# Altium project Power_Board.PrjPcb (part 1 of 3)
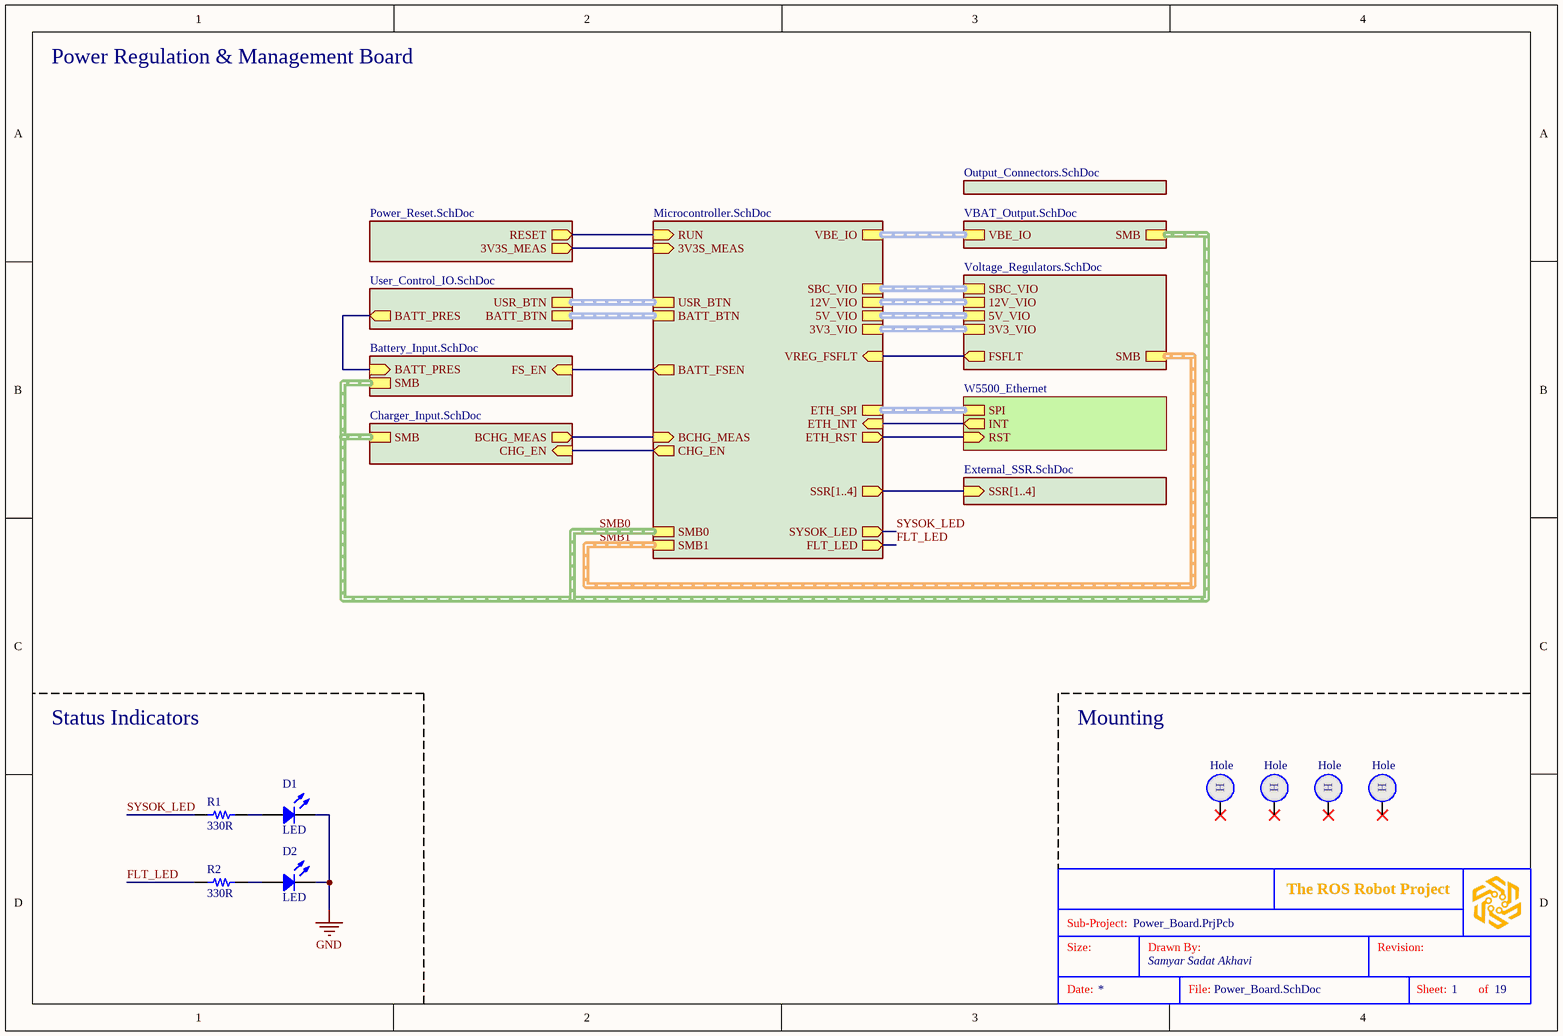
[diagram p0: Power_Board.SchDoc]
MainProjectName: The ROS Robot Project
16 sheets, 391 parts. Net scope: hierarchical (ports join the sheet entries above them; power ports are global).
Board file: Power_Board.PcbDoc
Sheets:
  Power_Board.SchDoc
    VOLT_REGS = Voltage_Regulators.SchDoc
      VREG_12V = Voltage_Reg_12V.SchDoc
      VREG_SBC = Voltage_Reg_SBC.SchDoc
      PROT_3V3 = STD_Protect.SchDoc
      PROT_SBC = HPW_Protect_SBC.SchDoc
      PROT_12V = STD_Protect.SchDoc
      VREG_3V3 = Voltage_Buck_3A.SchDoc
      PROT_5V = STD_Protect.SchDoc
      VREG_5V = Voltage_Buck_3A.SchDoc
    PWR = Power_Reset.SchDoc
    MCU = Microcontroller.SchDoc
    BATT = Battery_Input.SchDoc
    OUT_CONNS = Output_Connectors.SchDoc
    CHG_IN = Charger_Input.SchDoc
    USR_CTRL = User_Control_IO.SchDoc
    EXT_SSR = External_SSR.SchDoc
    VBAT_OUT = VBAT_Output.SchDoc
      VBAT_OUT = HPW_Protect_VBAT.SchDoc

## Sheet Power_Board.SchDoc: =SheetTitle
size A4; SheetTitle: Power Management Board; DrawnBy: Samyar Sadat Akhavi; DocumentNumber: 1; SheetNumber: 1; SheetTotal: 19

### Parts
(Parts that share a designator on the sheet are numbered #1, #2 ... from top to bottom, then left to right.)
?#1  (no value)  (graphical)
D1  LED  [LED 0805_2012]
D2  LED  [LED 0805_2012]
MHL1  Hole  [Hole_3.5mm]  (no BOM)
MHL2  Hole  [Hole_3.5mm]  (no BOM)
MHL3  Hole  [Hole_3.5mm]  (no BOM)
MHL4  Hole  [Hole_3.5mm]  (no BOM)
R1  330R  [RES 0603_1608]
R2  330R  [RES 0603_1608]

### Sub-sheets
BATT = Battery_Input.SchDoc: FS_EN (in), BATT_PRES (in), SMB (harness SMBus)
CHG_IN = Charger_Input.SchDoc: CHG_EN (in), BCHG_MEAS (out), SMB (harness SMBus)
ETHERNET = W5500_Ethernet (file not in this document): RST (in), SPI (harness SPI_FD), INT (out)
EXT_SSR = External_SSR.SchDoc: SSR[1..4] (in)
MCU = Microcontroller.SchDoc: RUN (in), 3V3S_MEAS (in), BATT_FSEN (out), USR_BTN (harness USR_BTN), BATT_BTN (harness USR_BTN), VBE_IO (harness VBP_IO), BCHG_MEAS (in), CHG_EN (out), SBC_VIO (harness VHP_VIO), 12V_VIO (harness VHP_VIO), 5V_VIO (harness V3I_VIO), 3V3_VIO (harness V3I_VIO), VREG_FSFLT (in), ETH_SPI (harness SPI_FD), ETH_INT (in), ETH_RST (out), SMB1 (harness SMBus), SMB0 (harness SMBus), FLT_LED (out), SYSOK_LED (out), SSR[1..4] (out)
OUT_CONNS = Output_Connectors.SchDoc: no entries
PWR = Power_Reset.SchDoc: RESET (out), 3V3S_MEAS (out)
USR_CTRL = User_Control_IO.SchDoc: BATT_PRES (out), BATT_BTN (harness USR_BTN), USR_BTN (harness USR_BTN)
VBAT_OUT = VBAT_Output.SchDoc: VBE_IO (harness VBP_IO), SMB (harness SMBus)
VOLT_REGS = Voltage_Regulators.SchDoc: SBC_VIO (harness VHP_VIO), 12V_VIO (harness VHP_VIO), 3V3_VIO (harness V3I_VIO), 5V_VIO (harness V3I_VIO), FSFLT (out), SMB (harness SMBus)

### Nets
GND: D1.2(K) D2.2(K)
3V3S_MEAS: sheet PWR/3V3S_MEAS, sheet MCU/3V3S_MEAS
BATT_PRES: sheet BATT/BATT_PRES, sheet USR_CTRL/BATT_PRES
BCHG_MEAS: sheet MCU/BCHG_MEAS, sheet CHG_IN/BCHG_MEAS
BEFS_EN: sheet MCU/BATT_FSEN, sheet BATT/FS_EN
CHG_EN: sheet MCU/CHG_EN, sheet CHG_IN/CHG_EN
ETH_INT: sheet MCU/ETH_INT, sheet ETHERNET/INT
ETH_RST: sheet MCU/ETH_RST, sheet ETHERNET/RST
FLT_LED: R2.1 ; sheet MCU/FLT_LED
FS_GFLT: sheet VOLT_REGS/FSFLT, sheet MCU/VREG_FSFLT
RESET: sheet PWR/RESET, sheet MCU/RUN
SYSOK_LED: R1.1 ; sheet MCU/SYSOK_LED
NetD1_1: D1.1(A) R1.2
NetD2_1: D2.1(A) R2.2

Not connected (* = marked no-connect by the designer): MHL1 1*; MHL2 1*; MHL3 1*; MHL4 1*

### Buses and harness runs
bus sheet EXT_SSR/SSR[1..4] = sheet MCU/SSR[1..4]
harness sheet ETHERNET/SPI = sheet MCU/ETH_SPI
harness sheet MCU/3V3_VIO = sheet VOLT_REGS/3V3_VIO
harness sheet MCU/5V_VIO = sheet VOLT_REGS/5V_VIO
harness sheet MCU/12V_VIO = sheet VOLT_REGS/12V_VIO
harness sheet MCU/BATT_BTN = sheet USR_CTRL/BATT_BTN
harness sheet MCU/SBC_VIO = sheet VOLT_REGS/SBC_VIO
harness sheet MCU/USR_BTN = sheet USR_CTRL/USR_BTN
harness sheet MCU/VBE_IO = sheet VBAT_OUT/VBE_IO
harness SMB0 = sheet BATT/SMB = sheet CHG_IN/SMB = sheet MCU/SMB0 = sheet VBAT_OUT/SMB
harness SMB1 = sheet MCU/SMB1 = sheet VOLT_REGS/SMB

### Notes on the sheet
- Power Regulation & Management Board
- Status Indicators
- Mounting
- Sub-Project:
- Size:
- Drawn By:
- Revision:
- Date:
- File:
- Sheet:
- of
- (in symbol GEN-PCBMHL3S5) H

### Library data of the parts
?#1 = SGR-STDTBSA4: STANDARD SCHEMATICS TITLE BLOCK
D1 = GEN-CILGRNLCLR805: GENERIC 0805 INDICATOR LED; Color: Green; Lens Color: Clear; Part Number: GEN-CILGRNLCLR805
D2 = GEN-CILAMBLCLR805: GENERIC 0805 INDICATOR LED; Color: Amber; Lens Color: Clear; Part Number: GEN-CILAMBLCLR805
MHL1-MHL4 = GEN-PCBMHL3S5: CIRCULAR PCB MOUNTING HOLE; Part Number: GEN-PCBMHL3S5; Size Variant: 3.5mm
R1 R2 = GEN-CRR330T5P8603: GENERIC 0603 CHIP RESISTOR; Tolerance: ±5%; Power: 0.125W; Part Number: GEN-CRR330T5P8603; Value: 330R

## Sheet Voltage_Regulators.SchDoc: =SheetTitle
size B; SheetTitle: Voltage Regulators; DrawnBy: Samyar Sadat Akhavi; DocumentNumber: 10; SheetNumber: 10; SheetTotal: 19
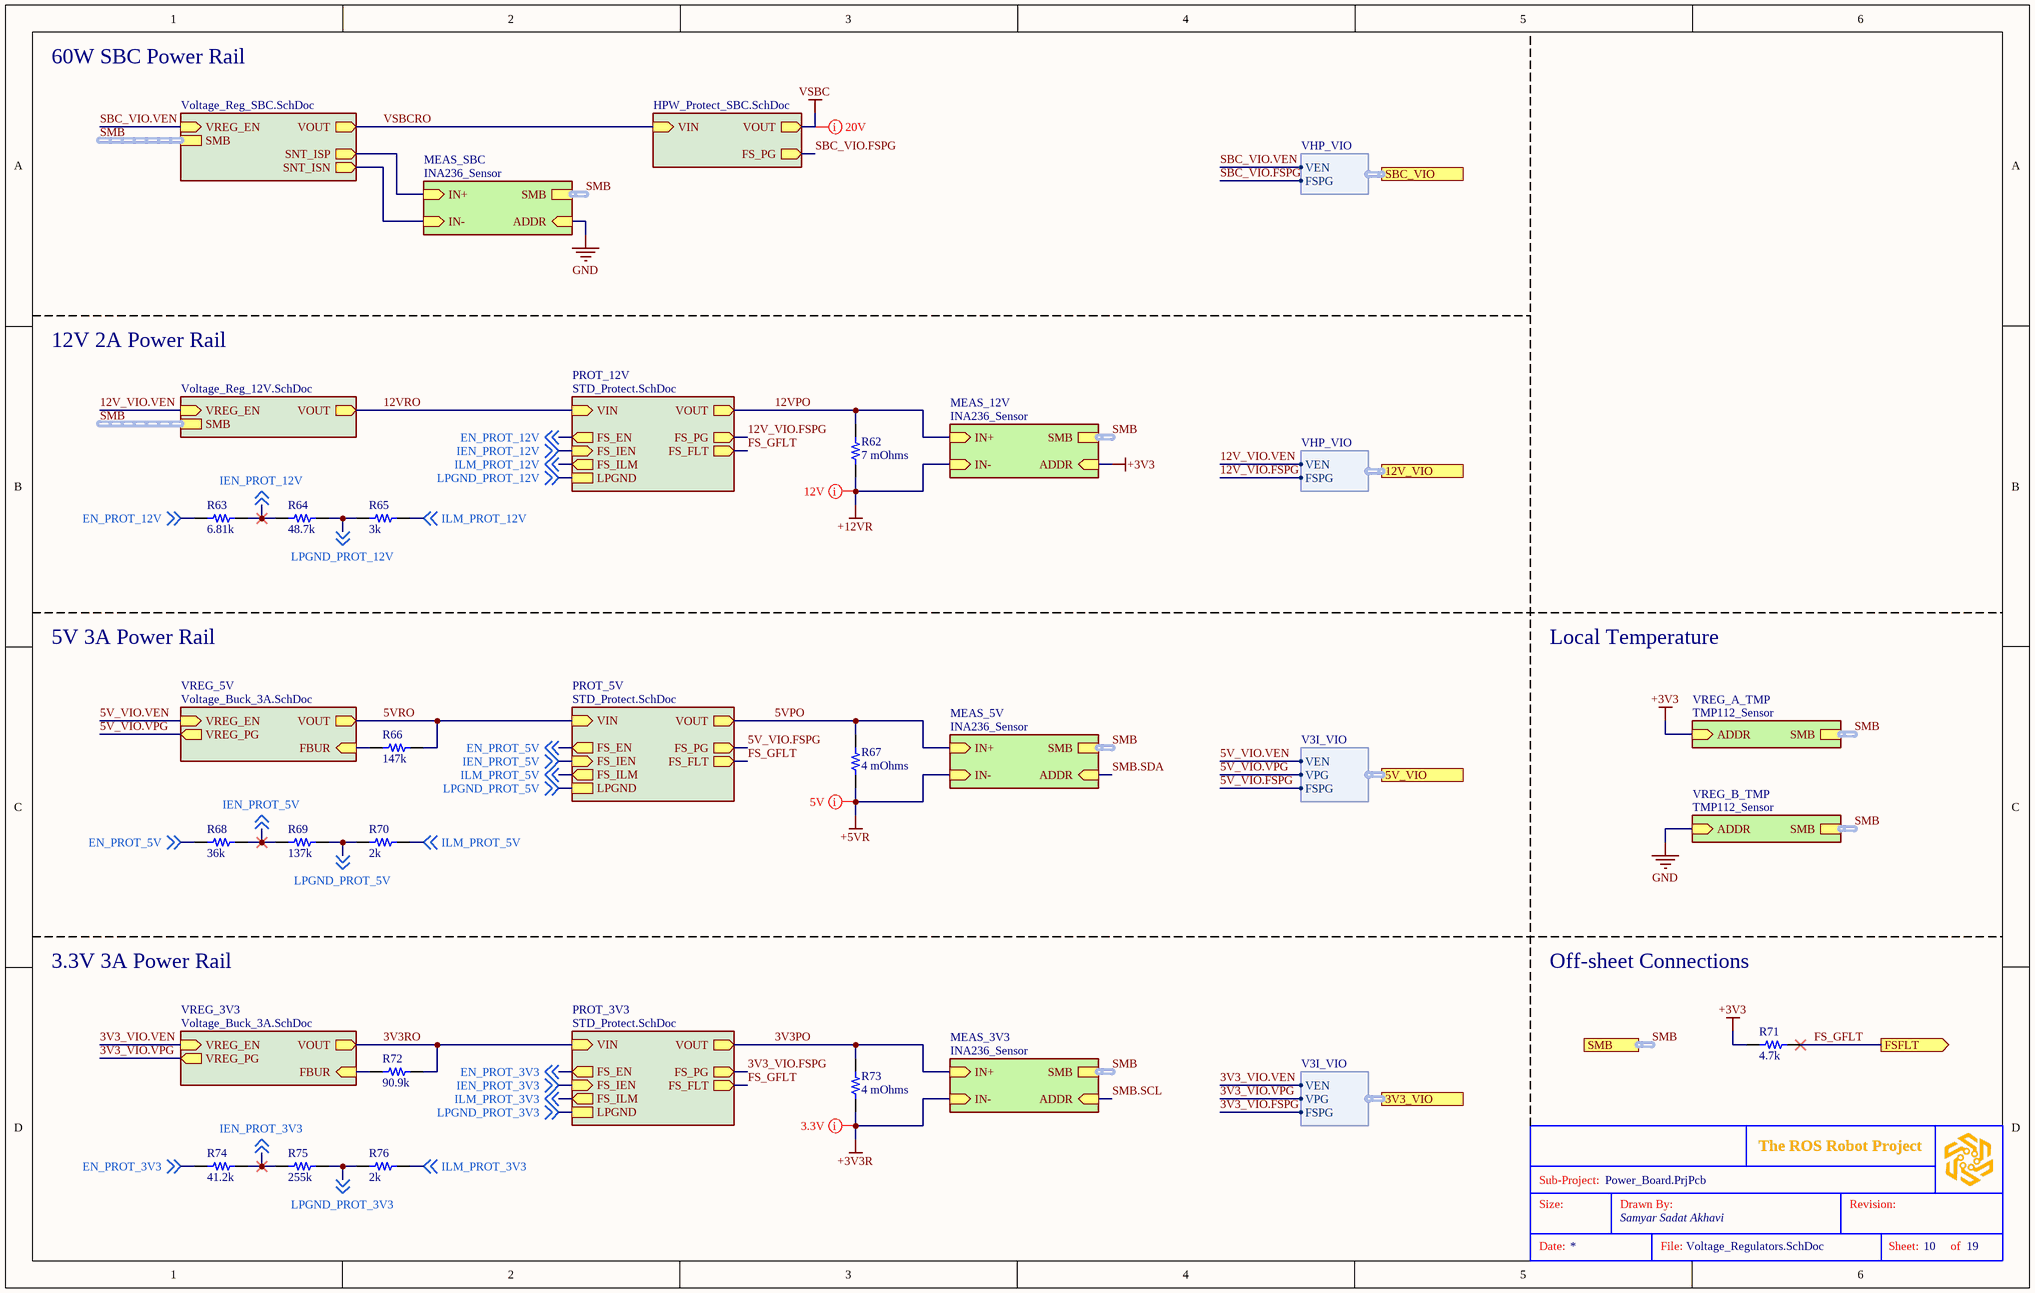
[diagram p1: Voltage_Regulators.SchDoc]

### Parts
(Parts that share a designator on the sheet are numbered #1, #2 ... from top to bottom, then left to right.)
?#2  (no value)  (graphical)
R62  7 mOhms  [RES 1206_3216]
R63  6.81k  [RES 0603_1608]
R64  48.7k  [RES 0603_1608]
R65  3k  [RES 0603_1608]
R66  147k  [RES 0603_1608]
R67  4 mOhms  [RES 1206_3216]
R68  36k  [RES 0603_1608]
R69  137k  [RES 0603_1608]
R70  2k  [RES 0603_1608]
R71  4.7k  [RES 0603_1608]
R72  90.9k  [RES 0603_1608]
R73  4 mOhms  [RES 1206_3216]
R74  41.2k  [RES 0603_1608]
R75  255k  [RES 0603_1608]
R76  2k  [RES 0603_1608]

### Sub-sheets
MEAS_3V3 = INA236_Sensor (file not in this document): IN- (in), ADDR (in), SMB (harness SMBus), IN+ (in)
MEAS_5V = INA236_Sensor (file not in this document): IN- (in), ADDR (in), SMB (harness SMBus), IN+ (in)
MEAS_12V = INA236_Sensor (file not in this document): IN- (in), ADDR (in), SMB (harness SMBus), IN+ (in)
MEAS_SBC = INA236_Sensor (file not in this document): IN- (in), ADDR (in), SMB (harness SMBus), IN+ (in)
PROT_3V3 = STD_Protect.SchDoc: FS_PG (out), FS_FLT (out), VIN (in), VOUT (out), FS_IEN (in), FS_ILM (out), LPGND, FS_EN (out)
PROT_5V = STD_Protect.SchDoc: FS_PG (out), FS_FLT (out), VIN (in), VOUT (out), FS_EN (out), FS_IEN (in), FS_ILM (out), LPGND
PROT_12V = STD_Protect.SchDoc: FS_PG (out), FS_FLT (out), VIN (in), VOUT (out), FS_IEN (in), FS_ILM (out), LPGND, FS_EN (out)
PROT_SBC = HPW_Protect_SBC.SchDoc: VIN (in), VOUT (out), FS_PG (out)
VREG_3V3 = Voltage_Buck_3A.SchDoc: VREG_EN (in), VOUT (out), VREG_PG (out), FBUR (in)
VREG_5V = Voltage_Buck_3A.SchDoc: VREG_EN (in), VOUT (out), VREG_PG (out), FBUR (in)
VREG_12V = Voltage_Reg_12V.SchDoc: SMB (harness SMBus), VREG_EN (in), VOUT (out)
VREG_A_TMP = TMP112_Sensor (file not in this document): ADDR (in), SMB (harness SMBus)
VREG_B_TMP = TMP112_Sensor (file not in this document): ADDR (in), SMB (harness SMBus)
VREG_SBC = Voltage_Reg_SBC.SchDoc: SMB (harness SMBus), VOUT (out), VREG_EN (in), SNT_ISN (out), SNT_ISP (out)

### Ports
3V3_VIO (harness V3I_VIO, see Power_Board[3B], Microcontroller[4B]), 5V_VIO (harness V3I_VIO, see Power_Board[3B], Microcontroller[4B]), 12V_VIO (harness VHP_VIO, see Power_Board[3B], Microcontroller[4A]), FSFLT (out, see Power_Board[3B]), SBC_VIO (harness VHP_VIO, see Power_Board[3B], Microcontroller[4A]), SMB (harness SMBus, see Power_Board[3B], INA236_Sensor[3B], TMP112_Sensor[3B], Voltage_Reg_12V[2C], Voltage_Reg_SBC[1B])

### Harnesses
V3I_VIO: VEN, VPG, FSPG
VHP_VIO: VEN, FSPG

### Nets
+3V3: R71.1 ; sheet VREG_A_TMP/ADDR, sheet MEAS_12V/ADDR
+3V3R: R73.1 ; sheet MEAS_3V3/IN-
+5VR: R67.1 ; sheet MEAS_5V/IN-
+12VR: R62.1 ; sheet MEAS_12V/IN-
GND: sheet VREG_B_TMP/ADDR, sheet MEAS_SBC/ADDR
LPGND_PROT_12V: R64.2 R65.1 R69.2 R70.2 R75.1 R76.2 ; off-sheet LPGND_PROT_12V, off-sheet LPGND_PROT_5V, off-sheet LPGND_PROT_3V3, sheet PROT_3V3/LPGND, sheet PROT_12V/LPGND, sheet PROT_5V/LPGND  [also labelled LPGND_PROT_3V3, LPGND_PROT_5V]  [project net LPGND]
3V3_VIO.FSPG: sheet PROT_3V3/FS_PG, port 3V3_VIO.FSPG
3V3_VIO.VEN: sheet VREG_3V3/VREG_EN, port 3V3_VIO.VEN
3V3_VIO.VPG: sheet VREG_3V3/VREG_PG, port 3V3_VIO.VPG
3V3PO: R73.2 ; sheet PROT_3V3/VOUT, sheet MEAS_3V3/IN+
3V3RO: R72.1 ; sheet PROT_3V3/VIN, sheet VREG_3V3/VOUT
5V_VIO.FSPG: sheet PROT_5V/FS_PG, port 5V_VIO.FSPG
5V_VIO.VEN: sheet VREG_5V/VREG_EN, port 5V_VIO.VEN
5V_VIO.VPG: sheet VREG_5V/VREG_PG, port 5V_VIO.VPG
5VPO: R67.2 ; sheet PROT_5V/VOUT, sheet MEAS_5V/IN+
5VRO: R66.2 ; sheet PROT_5V/VIN, sheet VREG_5V/VOUT
12V_VIO.FSPG: sheet PROT_12V/FS_PG, port 12V_VIO.FSPG
12V_VIO.VEN: sheet VREG_12V/VREG_EN, port 12V_VIO.VEN
12VPO: R62.2 ; sheet PROT_12V/VOUT, sheet MEAS_12V/IN+
12VRO: sheet VREG_12V/VOUT, sheet PROT_12V/VIN
EN_PROT_3V3: R74.2 ; off-sheet EN_PROT_3V3, sheet PROT_3V3/FS_EN
EN_PROT_5V: R68.1 ; off-sheet EN_PROT_5V, sheet PROT_5V/FS_EN
EN_PROT_12V: R63.1 ; off-sheet EN_PROT_12V, sheet PROT_12V/FS_EN
FBUR: R72.2 ; sheet VREG_3V3/FBUR
FBUR: R66.1 ; sheet VREG_5V/FBUR  [a separate net that carries the same name]
FS_GFLT: R71.2 ; port FSFLT, sheet PROT_3V3/FS_FLT, sheet PROT_12V/FS_FLT, sheet PROT_5V/FS_FLT
IEN_PROT_3V3: R74.1 R75.2 ; off-sheet IEN_PROT_3V3, sheet PROT_3V3/FS_IEN
IEN_PROT_5V: R68.2 R69.1 ; off-sheet IEN_PROT_5V, sheet PROT_5V/FS_IEN
IEN_PROT_12V: R63.2 R64.1 ; off-sheet IEN_PROT_12V, sheet PROT_12V/FS_IEN
ILM_PROT_3V3: R76.1 ; off-sheet ILM_PROT_3V3, sheet PROT_3V3/FS_ILM
ILM_PROT_5V: R70.1 ; off-sheet ILM_PROT_5V, sheet PROT_5V/FS_ILM
ILM_PROT_12V: R65.2 ; off-sheet ILM_PROT_12V, sheet PROT_12V/FS_ILM
SBC_VIO.FSPG: sheet PROT_SBC/FS_PG, port SBC_VIO.FSPG
SBC_VIO.VEN: sheet VREG_SBC/VREG_EN, port SBC_VIO.VEN
SMB.SCL: sheet MEAS_3V3/ADDR
SMB.SDA: sheet MEAS_5V/ADDR
VS_ISP: sheet VREG_SBC/SNT_ISP, sheet MEAS_SBC/IN+
VSBCRO: sheet VREG_SBC/VOUT, sheet VREG_SBC/SNT_ISN, sheet PROT_SBC/VIN, sheet MEAS_SBC/IN-

### Buses and harness runs
harness SMB = port SMB
harness SMB = sheet MEAS_3V3/SMB
harness SMB = sheet MEAS_5V/SMB
harness SMB = sheet MEAS_12V/SMB
harness SMB = sheet MEAS_SBC/SMB
harness SMB = sheet VREG_12V/SMB
harness SMB = sheet VREG_A_TMP/SMB
harness SMB = sheet VREG_B_TMP/SMB
harness SMB = sheet VREG_SBC/SMB

### Layout directives
rule Supply Nets [Voltage = 20.00]: VSBC
rule Supply Nets [Voltage = 12.00]: +12VR
rule Supply Nets [Voltage = 5.000]: +5VR
rule Supply Nets [Voltage = 3.300]: +3V3R

### Notes on the sheet
- 60W SBC Power Rail
- 12V 2A Power Rail
- 5V 3A Power Rail
- Local Temperature
- 3.3V 3A Power Rail
- Off-sheet Connections
- Sub-Project:
- Size:
- Drawn By:
- Revision:
- Date:
- File:
- Sheet:
- of

### Library data of the parts
?#2 = SGR-STDTBSB: STANDARD SCHEMATICS TITLE BLOCK
R62 = TLR2B10DR007FTDG: RES 0.007 OHM 1% 1W 1206; Manufacturer: TE Connectivity Passive Product; Temperature Coefficient: ±50ppm/°C; Part Number: TLR2B10DR007FTDG; ComponentLink1Description: Datasheet; ComponentLink1URL: https://www.te.com/commerce/DocumentDelivery/DDEController?Action=srchrtrv&DocNm=1773449-3&DocType=DS&DocLang=English; ComponentLink2Description: DigiKey Link; ComponentLink2URL: https://www.digikey.com/en/products/detail/te-connectivity-passive-product/TLR2B10DR007FTDG/5584869; Composition: Metal Foil; Device Package: 1206 (3216 Metric); Features: Current Sense; Height - Seated (Max): 0.024" (0.60mm); LastUpdated: 4/6/2026 8:00:51 PM; Lifecycle Status: Active; Minimum Order: 1; Number of Terminations: 2; Operating Temperature: -55°C ~ 170°C; Package / Case: 1206 (3216 Metric); Packaging: TapeAndReel; PartId: 27144; Part Status: Active; Power (Watts): 1W; Price: 0.32; Resistance: 7 mOhms; Series: TLR, CGS; Size / Dimension: 0.126" L x 0.063" W (3.20mm x 1.60mm); Supplier 1: DigiKey; Supplier Part Number 1: A131747CT-ND; Supplier Device Package: 1206; Tolerance: ±1%; Value: 7 mOhms
R63 = GEN-CRR6K81T1P8603: GENERIC 0603 CHIP RESISTOR; Tolerance: ±1%; Power: 0.125W; Part Number: GEN-CRR6K81T1P8603; Value: 6.81k
R64 = GEN-CRR48K7T1P8603: GENERIC 0603 CHIP RESISTOR; Tolerance: ±1%; Power: 0.125W; Part Number: GEN-CRR48K7T1P8603; Value: 48.7k
R65 = GEN-CRR3KT1P8603: GENERIC 0603 CHIP RESISTOR; Tolerance: ±1%; Power: 0.125W; Part Number: GEN-CRR3KT1P8603; Value: 3k
R66 = GEN-CRR147KT1P8603: GENERIC 0603 CHIP RESISTOR; Tolerance: ±1%; Power: 0.125W; Part Number: GEN-CRR147KT1P8603; Value: 147k
R67 R73 = TLR2B10DR004FTDG: RES 0.004 OHM 1% 1W 1206; Manufacturer: TE Connectivity Passive Product; Temperature Coefficient: ±50ppm/°C; Part Number: TLR2B10DR004FTDG; ComponentLink1Description: Datasheet; ComponentLink1URL: https://www.te.com/commerce/DocumentDelivery/DDEController?Action=srchrtrv&DocNm=1773449-3&DocType=DS&DocLang=English; ComponentLink2Description: DigiKey Link; ComponentLink2URL: https://www.digikey.com/en/products/detail/te-connectivity-passive-product/TLR2B10DR004FTDG/5584867; Composition: Metal Foil; Device Package: 1206 (3216 Metric); Features: Current Sense; Height - Seated (Max): 0.024" (0.60mm); LastUpdated: 4/6/2026 7:59:33 PM; Lifecycle Status: Active; Minimum Order: 1; Number of Terminations: 2; Operating Temperature: -55°C ~ 170°C; Package / Case: 1206 (3216 Metric); Packaging: TapeAndReel; PartId: 42701; Part Status: Active; Power (Watts): 1W; Price: 0.31; Resistance: 4 mOhms; Series: TLR, CGS; Size / Dimension: 0.126" L x 0.063" W (3.20mm x 1.60mm); Supplier 1: DigiKey; Supplier Part Number 1: A129560CT-ND; Supplier Device Package: 1206; Tolerance: ±1%; Value: 4 mOhms
R68 = GEN-CRR36KT1P8603: GENERIC 0603 CHIP RESISTOR; Tolerance: ±1%; Power: 0.125W; Part Number: GEN-CRR36KT1P8603; Value: 36k
R69 = GEN-CRR137KT1P8603: GENERIC 0603 CHIP RESISTOR; Tolerance: ±1%; Power: 0.125W; Part Number: GEN-CRR137KT1P8603; Value: 137k
R70 R76 = GEN-CRR2KT1P8603: GENERIC 0603 CHIP RESISTOR; Tolerance: ±1%; Power: 0.125W; Part Number: GEN-CRR2KT1P8603; Value: 2k
R71 = GEN-CRR4K7T5P8603: GENERIC 0603 CHIP RESISTOR; Tolerance: ±5%; Power: 0.125W; Part Number: GEN-CRR4K7T5P8603; Value: 4.7k
R72 = GEN-CRR90K9T1P8603: GENERIC 0603 CHIP RESISTOR; Tolerance: ±1%; Power: 0.125W; Part Number: GEN-CRR90K9T1P8603; Value: 90.9k
R74 = GEN-CRR41K2T1P8603: GENERIC 0603 CHIP RESISTOR; Tolerance: ±1%; Power: 0.125W; Part Number: GEN-CRR41K2T1P8603; Value: 41.2k
R75 = GEN-CRR255KT1P8603: GENERIC 0603 CHIP RESISTOR; Tolerance: ±1%; Power: 0.125W; Part Number: GEN-CRR255KT1P8603; Value: 255k

## Sheet Voltage_Reg_12V.SchDoc: =SheetTitle
size B; SheetTitle: 12V Buck-Boost Reg.; DrawnBy: Samyar Sadat Akhavi; DocumentNumber: 12; SheetNumber: 12; SheetTotal: 19
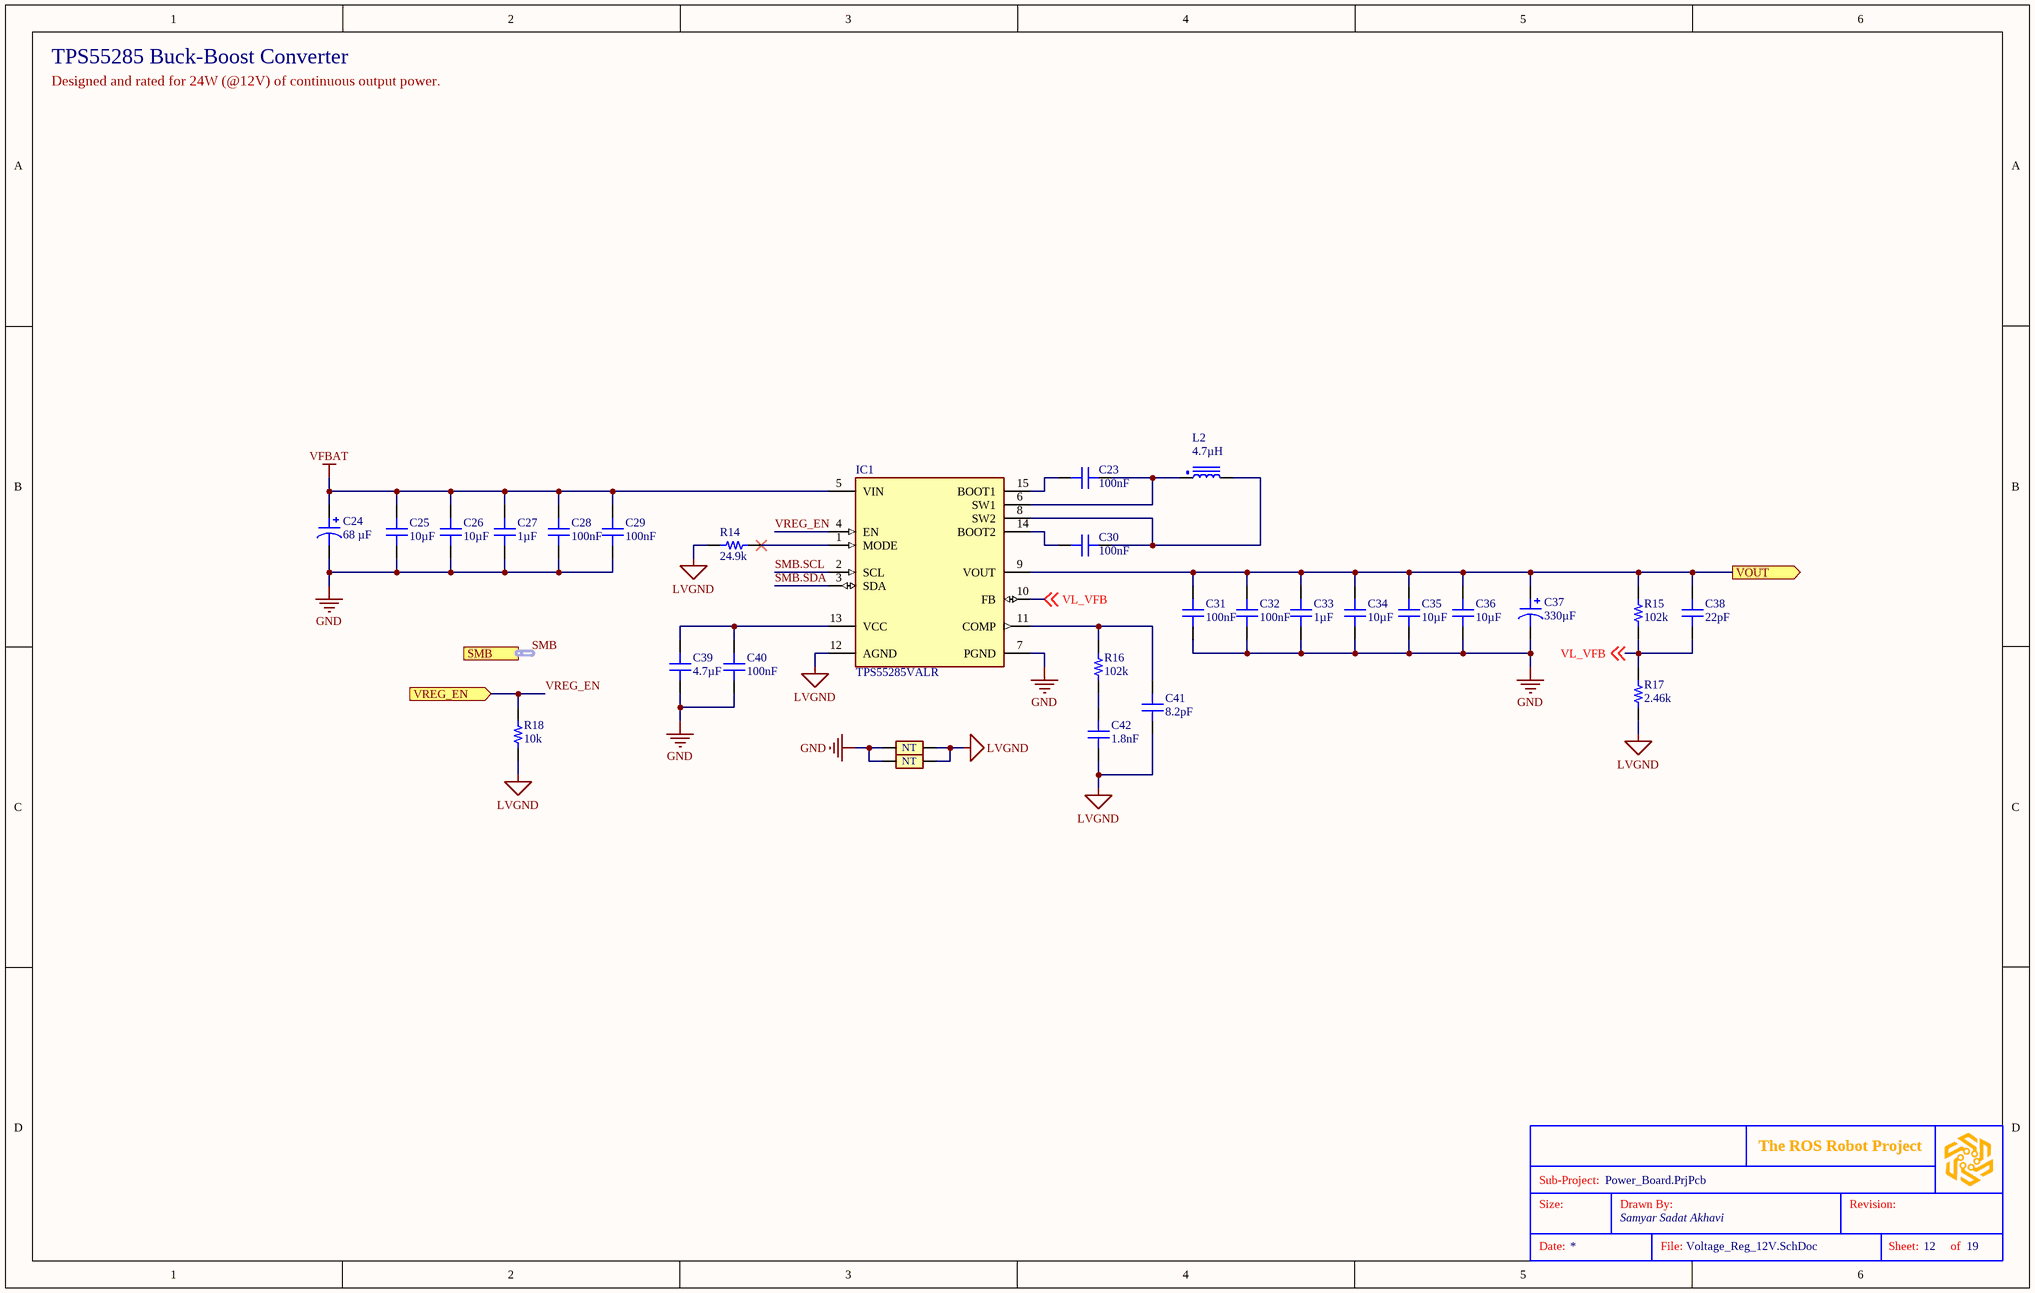
[diagram p2: Voltage_Reg_12V.SchDoc]

### Parts
(Parts that share a designator on the sheet are numbered #1, #2 ... from top to bottom, then left to right.)
?#3  (no value)  (graphical)
C23  100nF  [CAP 0603_1608]
C24  68 µF  [CAP ALSMD 6.6MM H7.7MM]
C25  10µF  [CAP 1206_3216]
C26  10µF  [CAP 1206_3216]
C27  1µF  [CAP 0603_1608]
C28  100nF  [CAP 0603_1608]
C29  100nF  [CAP 0603_1608]
C30  100nF  [CAP 0603_1608]
C31  100nF  [CAP 0603_1608]
C32  100nF  [CAP 0603_1608]
C33  1µF  [CAP 0603_1608]
C34  10µF  [CAP 1206_3216]
C35  10µF  [CAP 1206_3216]
C36  10µF  [CAP 1206_3216]
C37  330µF  [CAPAE830X1250N]
C38  22pF  [CAP 0603_1608]
C39  4.7µF  [CAP 1206_3216]
C40  100nF  [CAP 0603_1608]
C41  8.2pF  [CAP 0603_1608]
C42  1.8nF  [CAP 0603_1608]
IC1  TPS55285VALR  [XTPS55285VALR]
L2  4.7µH  [B82477G4472M000]
NT4  Net Tie  [Net_Tie_Via]  (value not drawn)  (net tie, no BOM)
NT5  Net Tie  [Net_Tie_Via]  (value not drawn)  (net tie, no BOM)
R14  24.9k  [RES 0603_1608]
R15  102k  [RES 0603_1608]
R16  102k  [RES 0603_1608]
R17  2.46k  [RES 0603_1608]
R18  10k  [RES 0603_1608]

### Ports
SMB (harness SMBus, see Voltage_Regulators[1B], INA236_Sensor[3B], TMP112_Sensor[3B], Voltage_Reg_SBC[1B], Voltage_Regulators[5D]), VOUT (out, see Voltage_Regulators[2B]), VREG_EN (in, see Voltage_Regulators[1B])

### Nets
GND: C24.2 C25.1 C26.1 C27.1 C28.1 C29.1 C31.1 C32.1 C33.1 C34.1 C35.1 C36.1 C37.2 C39.1 C40.1 IC1.7(PGND) NT4.1 NT5.1
LVGND: C41.1 C42.1 IC1.12(AGND) NT4.2 NT5.2 R14.1 R17.1 R18.2
VFBAT: C24.1 C25.2 C26.2 C27.2 C28.2 C29.2 IC1.5(VIN)
12VRO: C31.2 C32.2 C33.2 C34.2 C35.2 C36.2 C37.1 C38.2 IC1.9(VOUT) R15.2 ; port VOUT
SMB.SCL: IC1.2(SCL)
SMB.SDA: IC1.3(SDA)
VL_VFB: C38.1 IC1.10(FB) R15.1 R17.2 ; off-sheet VL_VFB
VREG_EN: IC1.4(EN) R18.1 ; port VREG_EN  [project net 12V_VIO.VEN]
NetC23_1: C23.1 IC1.6(SW1) L2.1
NetC23_2: C23.2 IC1.15(BOOT1)
NetC30_1: C30.1 IC1.8(SW2) L2.2
NetC30_2: C30.2 IC1.14(BOOT2)
NetC39_2: C39.2 C40.2 IC1.13(VCC)
NetC41_2: C41.2 IC1.11(COMP) R16.2
NetC42_2: C42.2 R16.1
NetIC1_1: IC1.1(MODE) R14.2

### Buses and harness runs
harness SMB = port SMB

### Notes on the sheet
- TPS55285 Buck-Boost Converter
- Designed and rated for 24W (@12V) of continuous output power.
- Sub-Project:
- Size:
- Drawn By:
- Revision:
- Date:
- File:
- Sheet:
- of
- (in symbol GEN-PCBVINT0S3) NT

### Library data of the parts
?#3 = SGR-STDTBSB: STANDARD SCHEMATICS TITLE BLOCK
C23 C28-C32 C40 = GEN-CC100NT10V50KX7R603: GENERIC 0603 MLC CAPACITOR; Tolerance: ±10%; Voltage: 50V; Dielectric: X7R; Part Number: GEN-CC100NT10V50KX7R603; Value: 100nF
C24 = 865080545011: CAP ALUM 68UF 20% 35V SMD; manufacturer: Würth Elektronik; Impedance: 400 mOhms; Lifetime @ Temp.: 2000 Hrs @ 105°C; Polarization: Polar; Ripple Current @ High Frequency: 265 mA @ 100 kHz; Ripple Current @ Low Frequency: 172.25 mA @ 120 Hz; Surface Mount Land Size: 0.260" L x 0.260" W (6.60mm x 6.60mm); Part Number: 865080545011; Applications: General Purpose; Capacitance: 68 µF; componentlink1description: Datasheet; componentlink1url: https://katalog.we-online.de/pbs/datasheet/865080545011.pdf; componentlink2description: DigiKey Link; componentlink2url: https://www.digikey.com/en/products/detail/würth-elektronik/865080545011/5728105; Device Package: Radial, Can - SMD; Height - Seated (Max): 0.303" (7.70mm); lastupdated: 4/5/2026 8:54:40 PM; Lifecycle Status: Active; Minimum Order: 1; Mounting Type: Surface Mount; Operating Temperature: -55°C ~ 105°C; Package / Case: Radial, Can - SMD; packaging: TapeAndReel; partid: 27323; Part Status: Active; price: 0.17; series: WCAP-ASLI; Size / Dimension: 0.248" Dia (6.30mm); Supplier 1: DigiKey; Supplier Part Number 1: 732-8510-1-ND; Tolerance: ±20%; value: 68 µF; Voltage - Rated: 35 V
C25 C26 C34-C36 = GEN-CC10UT10V25KX7R1206: GENERIC 1206 MLC CAPACITOR; Tolerance: ±10%; Voltage: 25V; Dielectric: X7R; Part Number: GEN-CC10UT10V25KX7R1206; Value: 10µF
C27 C33 = GEN-CC1UT10V25KX7R603: GENERIC 0603 MLC CAPACITOR; Tolerance: ±10%; Voltage: 25V; Dielectric: X7R; Part Number: GEN-CC1UT10V25KX7R603; Value: 1µF
C37 = A768KS337M1ELAS019: CAP ALUM POLY 330UF 20% 25V SMD; Manufacturer: KEMET; ESR: 19mOhm; Lifetime Temp: 2000 Hrs @ 125°C; Part Number: A768KS337M1ELAS019; Value: 330µF; Tolerance: ±20%; Voltage: 25V; Supplier 1: DigiKey; Supplier Part Number 1: 399-A768KS337M1ELAS019CT-ND
C38 = GEN-CC22PT10V16KX7R603: GENERIC 0603 MLC CAPACITOR; Tolerance: ±10%; Voltage: 16V; Dielectric: X7R; Part Number: GEN-CC22PT10V16KX7R603; Value: 22pF
C39 = GEN-CC4U7T10V25KX7R1206: GENERIC 1206 MLC CAPACITOR; Tolerance: ±10%; Voltage: 25V; Dielectric: X7R; Part Number: GEN-CC4U7T10V25KX7R1206; Value: 4.7µF
C41 = GEN-CC8P2TCV50KC0G603: GENERIC 0603 MLC CAPACITOR; Tolerance: ±0.25pF; Voltage: 50V; Dielectric: C0G; Part Number: GEN-CC8P2TCV50KC0G603; Value: 8.2pF
C42 = GEN-CC1N8T5V50KC0G603: GENERIC 0603 MLC CAPACITOR; Tolerance: ±5%; Voltage: 50V; Dielectric: C0G; Part Number: GEN-CC1N8T5V50KC0G603; Value: 1.8nF
IC1 = TPS55285VALR: 22V 8A BUCK-BOOST CONVERTER WITH; Manufacturer: Texas Instruments; Part Number: TPS55285VALR; Supplier 1: DigiKey; Supplier Part Number 1: 296-TPS55285VALRCT-ND
L2 = B82477G4472M000: FIXED IND 4.7UH 6.8A 14 MOHM SMD; Manufacturer: TDK; Tolerance: ±20%; Saturation Current: 8.6A; DC Resistance: 14mOhm; Part Number: B82477G4472M000; Value: 4.7µH; Current Rating: 6.8A; Supplier 1: DigiKey; Supplier Part Number 1: 495-1821-1-ND
NT4 NT5 = GEN-PCBVINT0S3: VIA STYLE CIRCULAR NET TIE; Part Number: GEN-PCBVINT0S3; Size Variant: 0.3mm
R14 = GEN-CRR24K9T1P8603: GENERIC 0603 CHIP RESISTOR; Tolerance: ±1%; Power: 0.125W; Part Number: GEN-CRR24K9T1P8603; Value: 24.9k
R15 R16 = GEN-CRR102KT1P8603: GENERIC 0603 CHIP RESISTOR; Tolerance: ±1%; Power: 0.125W; Part Number: GEN-CRR102KT1P8603; Value: 102k
R17 = GEN-CRR2K46T1P8603: GENERIC 0603 CHIP RESISTOR; Tolerance: ±1%; Power: 0.125W; Part Number: GEN-CRR2K46T1P8603; Value: 2.46k
R18 = GEN-CRR10KT1P8603: GENERIC 0603 CHIP RESISTOR; Tolerance: ±1%; Power: 0.125W; Part Number: GEN-CRR10KT1P8603; Value: 10k

## Sheet Voltage_Reg_SBC.SchDoc: =SheetTitle
size B; SheetTitle: 60W SBC Buck-Boost Reg.; DrawnBy: Samyar Sadat Akhavi; DocumentNumber: 11; SheetNumber: 11; SheetTotal: 19
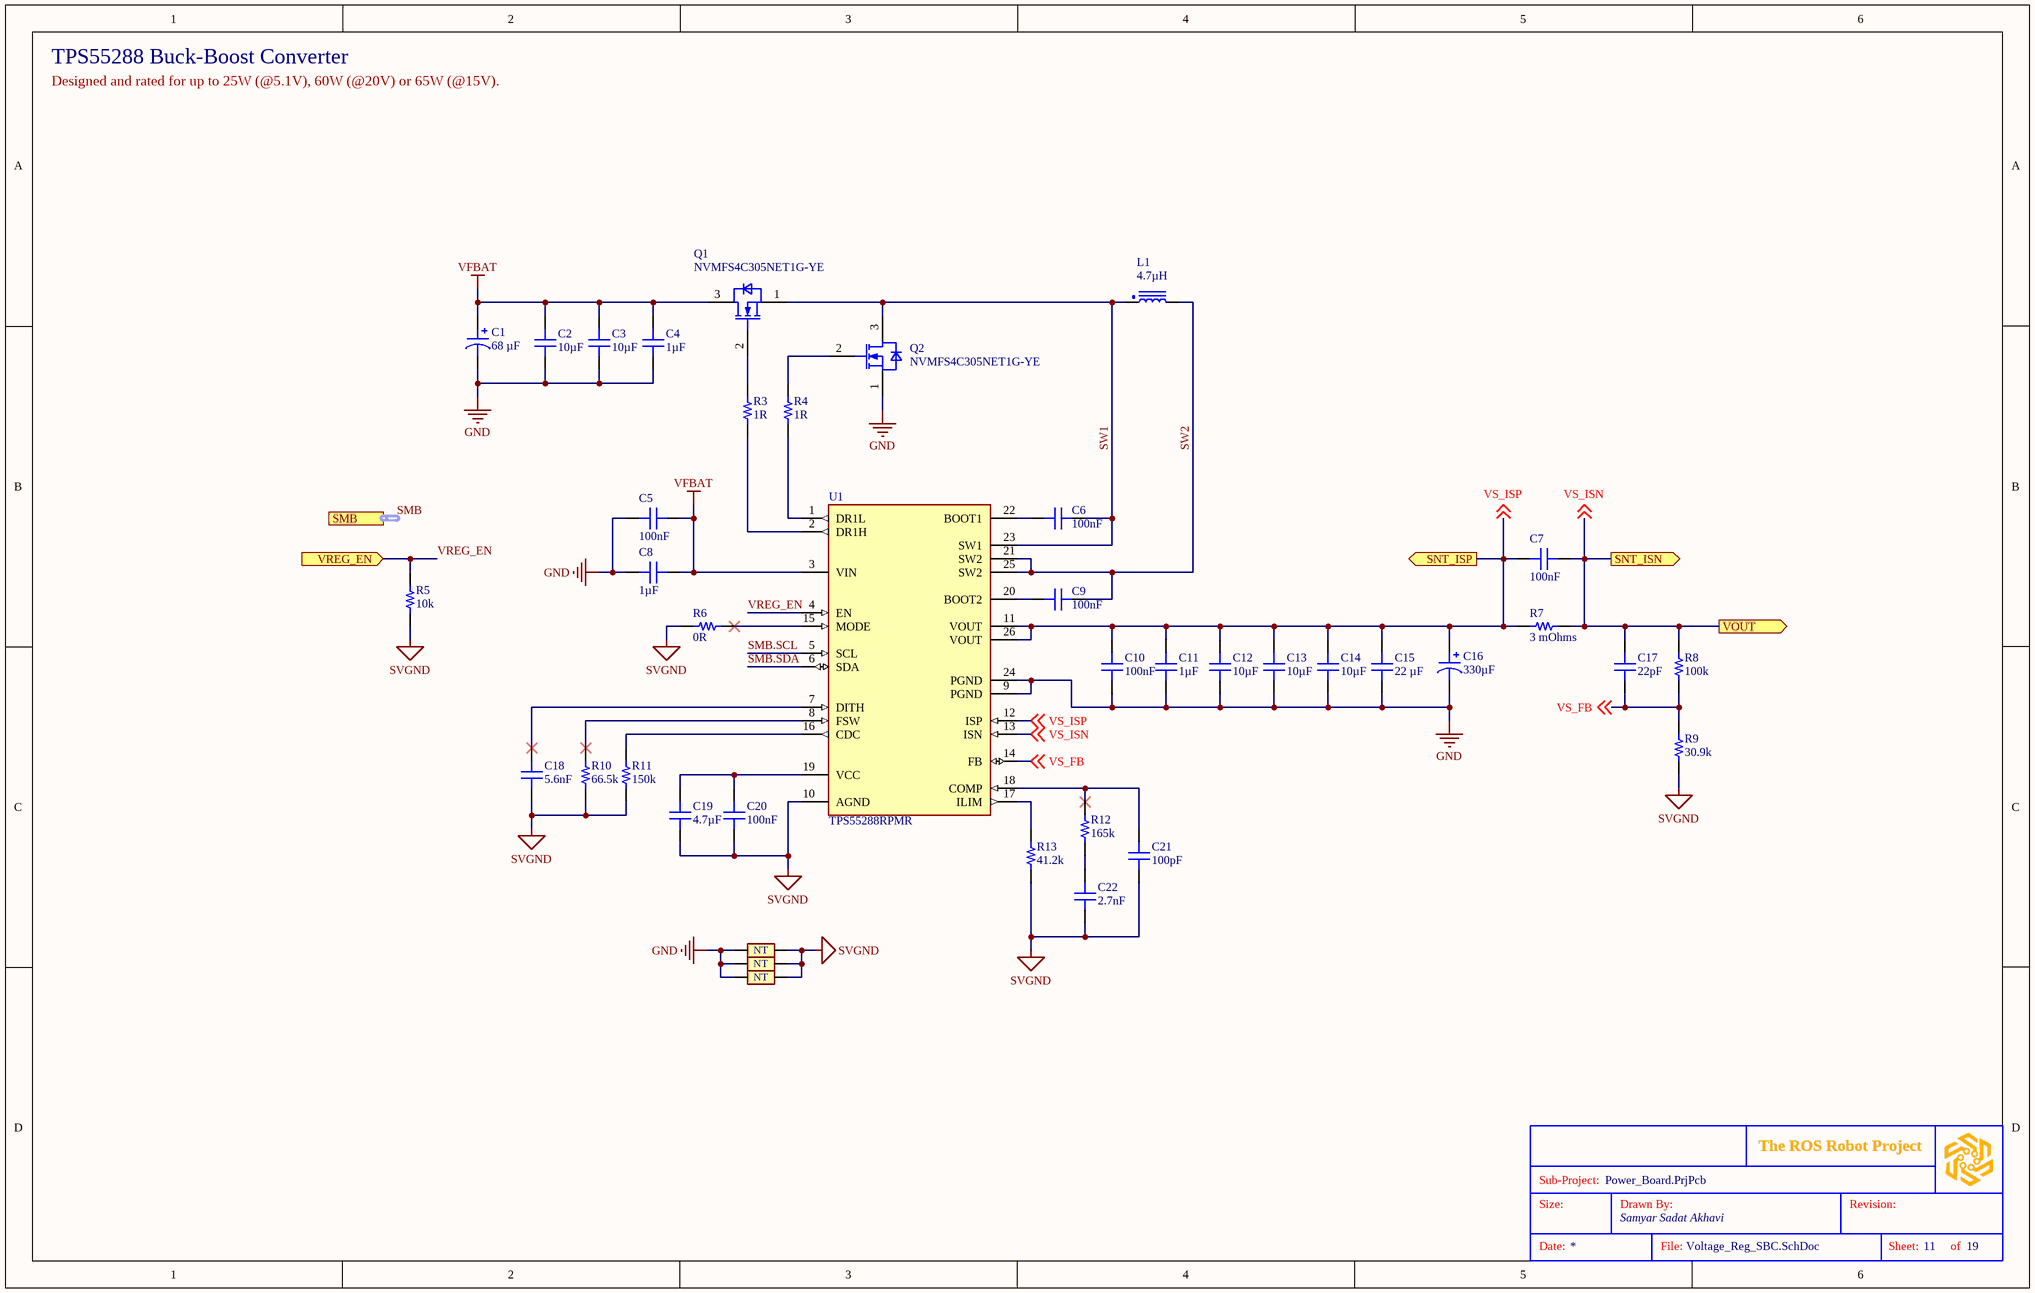
[diagram p3: Voltage_Reg_SBC.SchDoc]

### Parts
(Parts that share a designator on the sheet are numbered #1, #2 ... from top to bottom, then left to right.)
?#4  (no value)  (graphical)
C1  68 µF  [CAP ALSMD 6.6MM H7.7MM]
C2  10µF  [CAP 1206_3216]
C3  10µF  [CAP 1206_3216]
C4  1µF  [CAP 0603_1608]
C5  100nF  [CAP 0603_1608]
C6  100nF  [CAP 0603_1608]
C7  100nF  [CAP 0603_1608]
C8  1µF  [CAP 0603_1608]
C9  100nF  [CAP 0603_1608]
C10  100nF  [CAP 0603_1608]
C11  1µF  [CAP 0603_1608]
C12  10µF  [CAP 1206_3216]
C13  10µF  [CAP 1206_3216]
C14  10µF  [CAP 1206_3216]
C15  22 µF  [CAP 1206_3216 - 0.8MM]
C16  330µF  [CAPAE830X1250N]
C17  22pF  [CAP 0603_1608]
C18  5.6nF  [CAP 0603_1608]
C19  4.7µF  [CAP 1206_3216]
C20  100nF  [CAP 0603_1608]
C21  100pF  [CAP 0603_1608]
C22  2.7nF  [CAP 0603_1608]
L1  4.7µH  [WE-HCC_121021]
NT1  Net Tie  [Net_Tie_Via]  (value not drawn)  (net tie, no BOM)
NT2  Net Tie  [Net_Tie_Via]  (value not drawn)  (net tie, no BOM)
NT3  Net Tie  [Net_Tie_Via]  (value not drawn)  (net tie, no BOM)
Q1  NVMFS4C305NET1G-YE  [NVMFS4C05NWFET1G]
Q2  NVMFS4C305NET1G-YE  [NVMFS4C05NWFET1G]
R3  1R  [RES 0603_1608]
R4  1R  [RES 0603_1608]
R5  10k  [RES 0603_1608]
R6  0R  [RES 0603_1608]
R7  3 mOhms  [RES 2512_6432]
R8  100k  [RES 0603_1608]
R9  30.9k  [RES 0603_1608]
R10  66.5k  [RES 0603_1608]
R11  150k  [RES 0603_1608]
R12  165k  [RES 0603_1608]
R13  41.2k  [RES 0603_1608]
U1  TPS55288RPMR  [VQFN-HR26_RPM_TEX]

### Ports
SMB (harness SMBus, see Voltage_Regulators[1A], INA236_Sensor[3B], TMP112_Sensor[3B], Voltage_Reg_12V[2C], Voltage_Regulators[5D]), SNT_ISN (out, see Voltage_Regulators[2A]), SNT_ISP (out, see Voltage_Regulators[2A]), VOUT (out, see Voltage_Regulators[2A]), VREG_EN (in, see Voltage_Regulators[1A])

### Nets
GND: C1.2 C2.1 C3.1 C4.1 C5.1 C8.2 C10.1 C11.1 C12.1 C13.1 C14.1 C15.1 C16.2 NT1.1 NT2.1 NT3.1 Q2.1(SOURCE) U1.9(PGND) U1.24(PGND)
SVGND: C18.1 C19.1 C20.1 C21.1 C22.1 NT1.2 NT2.2 NT3.2 R5.2 R6.1 R9.1 R10.1 R11.1 R13.1 U1.10(AGND)
VFBAT: C1.1 C2.2 C3.2 C4.2 C5.2 C8.1 Q1.3(DRAIN) U1.3(VIN)
SMB.SCL: U1.5(SCL)
SMB.SDA: U1.6(SDA)
SW1: C6.1 L1.1 Q1.1(SOURCE) Q2.3(DRAIN) U1.23(SW1)
SW2: C9.1 L1.2 U1.21(SW2) U1.25(SW2)
VREG_EN: R5.1 U1.4(EN) ; port VREG_EN  [project net SBC_VIO.VEN]
VS_FB: C17.1 R8.1 R9.2 U1.14(FB) ; off-sheet VS_FB
VS_ISN: C7.2 C17.2 R7.2 R8.2 U1.13(ISN) ; off-sheet VS_ISN, port VOUT, port SNT_ISN  [project net VSBCRO]
VS_ISP: C7.1 C10.2 C11.2 C12.2 C13.2 C14.2 C15.2 C16.1 R7.1 U1.11(VOUT) U1.12(ISP) U1.26(VOUT) ; off-sheet VS_ISP, port SNT_ISP
NetC6_2: C6.2 U1.22(BOOT1)
NetC9_2: C9.2 U1.20(BOOT2)
NetC18_2: C18.2 U1.7(DITH)
NetC19_2: C19.2 C20.2 U1.19(VCC)
NetC21_2: C21.2 R12.2 U1.18(COMP)
NetC22_2: C22.2 R12.1
NetQ1_2: Q1.2(GATE) R3.2
NetQ2_2: Q2.2(GATE) R4.2
NetR3_1: R3.1 U1.2(DR1H)
NetR4_1: R4.1 U1.1(DR1L)
NetR6_2: R6.2 U1.15(MODE)
NetR10_2: R10.2 U1.8(FSW)
NetR11_2: R11.2 U1.16(CDC)
NetR13_2: R13.2 U1.17(ILIM)

### Buses and harness runs
harness SMB = port SMB

### Notes on the sheet
- TPS55288 Buck-Boost Converter
- Designed and rated for up to 25W (@5.1V), 60W (@20V) or 65W (@15V).
- Sub-Project:
- Size:
- Drawn By:
- Revision:
- Date:
- File:
- Sheet:
- of
- (in symbol GEN-PCBVINT0S3) NT

### Library data of the parts
?#4 = SGR-STDTBSB: STANDARD SCHEMATICS TITLE BLOCK
C1 = 865080545011: as C24 on sheet Voltage_Reg_12V; Part Number: 865080545011; Applications: General Purpose; Capacitance: 68 µF; componentlink1description: Datasheet; componentlink1url: https://katalog.we-online.de/pbs/datasheet/865080545011.pdf; componentlink2description: DigiKey Link; componentlink2url: https://www.digikey.com/en/products/detail/würth-elektronik/865080545011/5728105; Device Package: Radial, Can - SMD; Height - Seated (Max): 0.303" (7.70mm); lastupdated: 4/5/2026 8:54:40 PM; Lifecycle Status: Active; Minimum Order: 1; Mounting Type: Surface Mount; Operating Temperature: -55°C ~ 105°C; Package / Case: Radial, Can - SMD; packaging: TapeAndReel; partid: 27323; Part Status: Active; price: 0.17; series: WCAP-ASLI; Size / Dimension: 0.248" Dia (6.30mm); Supplier 1: DigiKey; Supplier Part Number 1: 732-8510-1-ND; Tolerance: ±20%; value: 68 µF; Voltage - Rated: 35 V
C2 C3 C12-C14 = GEN-CC10UT10V25KX7R1206: as C25 on sheet Voltage_Reg_12V; Part Number: GEN-CC10UT10V25KX7R1206; Value: 10µF
C4 C8 C11 = GEN-CC1UT10V25KX7R603: as C27 on sheet Voltage_Reg_12V; Part Number: GEN-CC1UT10V25KX7R603; Value: 1µF
C5-C7 C9 C10 C20 = GEN-CC100NT10V50KX7R603: as C23 on sheet Voltage_Reg_12V; Part Number: GEN-CC100NT10V50KX7R603; Value: 100nF
C15 = CL31A226KAHNNNE: CAP CER 22UF 25V X5R 1206; manufacturer: Samsung Electro-Mechanics; Tolerance: ±10%; Part Number: CL31A226KAHNNNE; Capacitance: 22 µF; Applications: General Purpose; componentlink1description: Datasheet; componentlink1url: http://www.samsungsem.com/kr/support/product-search/mlcc/CL31A226KAHNNNE.jsp; componentlink2description: DigiKey Link; componentlink2url: https://www.digikey.com/en/products/detail/samsung-electro-mechanics/CL31A226KAHNNNE/3888705; Device Package: 1206 (3216 Metric); lastupdated: 4/6/2026 7:37:25 PM; Lifecycle Status: Active; Minimum Order: 1; Mounting Type: Surface Mount, MLCC; Operating Temperature: -55°C ~ 85°C; Package / Case: 1206 (3216 Metric); packaging: TapeAndReel; partid: 22185; Part Status: Active; price: 0.06; series: CL; Size / Dimension: 0.126" L x 0.063" W (3.20mm x 1.60mm); Supplier 1: DigiKey; Supplier Part Number 1: 1276-3047-1-ND; Temperature Coefficient: X5R; Thickness (Max): 0.071" (1.80mm); value: 22 µF; Voltage - Rated: 25V
C16 = A768KS337M1ELAS019: as C37 on sheet Voltage_Reg_12V; Part Number: A768KS337M1ELAS019; Value: 330µF; Tolerance: ±20%; Voltage: 25V; Supplier 1: DigiKey; Supplier Part Number 1: 399-A768KS337M1ELAS019CT-ND
C17 = GEN-CC22PT10V16KX7R603: as C38 on sheet Voltage_Reg_12V; Part Number: GEN-CC22PT10V16KX7R603; Value: 22pF
C18 = GEN-CC5N6T10V50KX7R603: GENERIC 0603 MLC CAPACITOR; Tolerance: ±10%; Voltage: 50V; Dielectric: X7R; Part Number: GEN-CC5N6T10V50KX7R603; Value: 5.6nF
C19 = GEN-CC4U7T10V25KX7R1206: as C39 on sheet Voltage_Reg_12V; Part Number: GEN-CC4U7T10V25KX7R1206; Value: 4.7µF
C21 = GEN-CC100PT5V50KC0G603: GENERIC 0603 MLC CAPACITOR; Tolerance: ±5%; Voltage: 50V; Dielectric: C0G; Part Number: GEN-CC100PT5V50KC0G603; Value: 100pF
C22 = GEN-CC2N7T10V50KX7R603: GENERIC 0603 MLC CAPACITOR; Tolerance: ±10%; Voltage: 50V; Dielectric: X7R; Part Number: GEN-CC2N7T10V50KX7R603; Value: 2.7nF
L1 = 7443320470: FIXED IND 4.7UH 15.5A 7.9 MOHM; Manufacturer: Würth Elektronik; Tolerance: ±20%; Saturation Current: 17A; Part Number: 7443320470; Value: 4.7µH; Current Rating: 15.5A; DC Resistance: 7.9mOhm; Supplier 1: DigiKey; Supplier Part Number 1: 732-2142-1-ND
NT1-NT3 = GEN-PCBVINT0S3: VIA STYLE CIRCULAR NET TIE; Part Number: GEN-PCBVINT0S3; Size Variant: 0.3mm
Q1 Q2 = NVMFS4C305NET1G-YE: SINGLE N-CHANNEL LOGIC LEVEL POW; Manufacturer: onsemi; Part Number: NVMFS4C305NET1G-YE; Supplier 1: DigiKey; Supplier Part Number 1: 488-NVMFS4C305NET1G-YE-ND
R3 R4 = GEN-CRR1T1P8603: GENERIC 0603 CHIP RESISTOR; Tolerance: ±1%; Power: 0.125W; Part Number: GEN-CRR1T1P8603; Value: 1R
R5 = GEN-CRR10KT1P8603: as R18 on sheet Voltage_Reg_12V; Part Number: GEN-CRR10KT1P8603; Value: 10k
R6 = GEN-CRR0603: GENERIC 0603 CHIP RESISTOR (JUMPER); Part Number: GEN-CRR0603; Value: 0R
R7 = TLR3A20KR003FTDG: RES 0.003 OHM 1% 2W 2512; manufacturer: TE Connectivity Passive Product; Temperature Coefficient: ±150ppm/°C; Part Number: TLR3A20KR003FTDG; componentlink1description: Datasheet; componentlink1url: https://www.te.com/commerce/DocumentDelivery/DDEController?Action=srchrtrv&DocNm=1773449-3&DocType=DS&DocLang=English; componentlink2description: DigiKey Link; componentlink2url: http://digikey.com/product-detail/en/te-connectivity-passive-product/TLR3A20KR003FTDG/A131783CT-ND/8603913; Composition: Metal Foil; Device Package: 2512 (6432 Metric); Features: Current Sense; Height - Seated (Max): 0.024" (0.60mm); lastupdated: 9/2/2020 1:27:06 AM; Lifecycle Status: Active; Minimum Order: 1; Number of Terminations: 2; Operating Temperature: -55°C ~ 170°C; Package / Case: 2512 (6432 Metric); packaging: TapeAndReel; Part Status: Active; Power (Watts): 2W; price: 0.30; Resistance: 3 mOhms; series: TLR, CGS; Size / Dimension: 0.252" L x 0.126" W (6.40mm x 3.20mm); Supplier 1: DigiKey; Supplier Part Number 1: A131783CT-ND; Supplier Device Package: 2512; Tolerance: ±1%; value: 3 mOhms
R8 = GEN-CRR100KT1P8603: GENERIC 0603 CHIP RESISTOR; Tolerance: ±1%; Power: 0.125W; Part Number: GEN-CRR100KT1P8603; Value: 100k
R9 = GEN-CRR30K9T1P8603: GENERIC 0603 CHIP RESISTOR; Tolerance: ±1%; Power: 0.125W; Part Number: GEN-CRR30K9T1P8603; Value: 30.9k
R10 = GEN-CRR66K5T1P8603: GENERIC 0603 CHIP RESISTOR; Tolerance: ±1%; Power: 0.125W; Part Number: GEN-CRR66K5T1P8603; Value: 66.5k
R11 = GEN-CRR150KT1P8603: GENERIC 0603 CHIP RESISTOR; Tolerance: ±1%; Power: 0.125W; Part Number: GEN-CRR150KT1P8603; Value: 150k
R12 = GEN-CRR165KT1P8603: GENERIC 0603 CHIP RESISTOR; Tolerance: ±1%; Power: 0.125W; Part Number: GEN-CRR165KT1P8603; Value: 165k
R13 = GEN-CRR41K2T1P8603: as R74 on sheet Voltage_Regulators; Part Number: GEN-CRR41K2T1P8603; Value: 41.2k
U1 = TPS55288RPMR: 36V, 16A BUCK-BOOST CONVERTER WITH PPS CONTROL; Manufacturer: Texas Instruments; Copyright: Copyright (C) 2026 Ultra Librarian. All rights reserved.; Part Number: TPS55288RPMR; Supplier 1: DigiKey; Supplier Part Number 1: 296-TPS55288RPMRCT-ND

## Sheet STD_Protect.SchDoc: =SheetTitle
size A4; SheetTitle: Standard Bus Protection; SheetTotal: 19; SheetNumber: 15; DocumentNumber: 15; DrawnBy: Samyar Sadat Akhavi
Used 3 times, as channels VOLT_REGS/PROT_3V3, VOLT_REGS/PROT_12V, VOLT_REGS/PROT_5V. Parts and nets are listed once, with the designators drawn on the sheet.
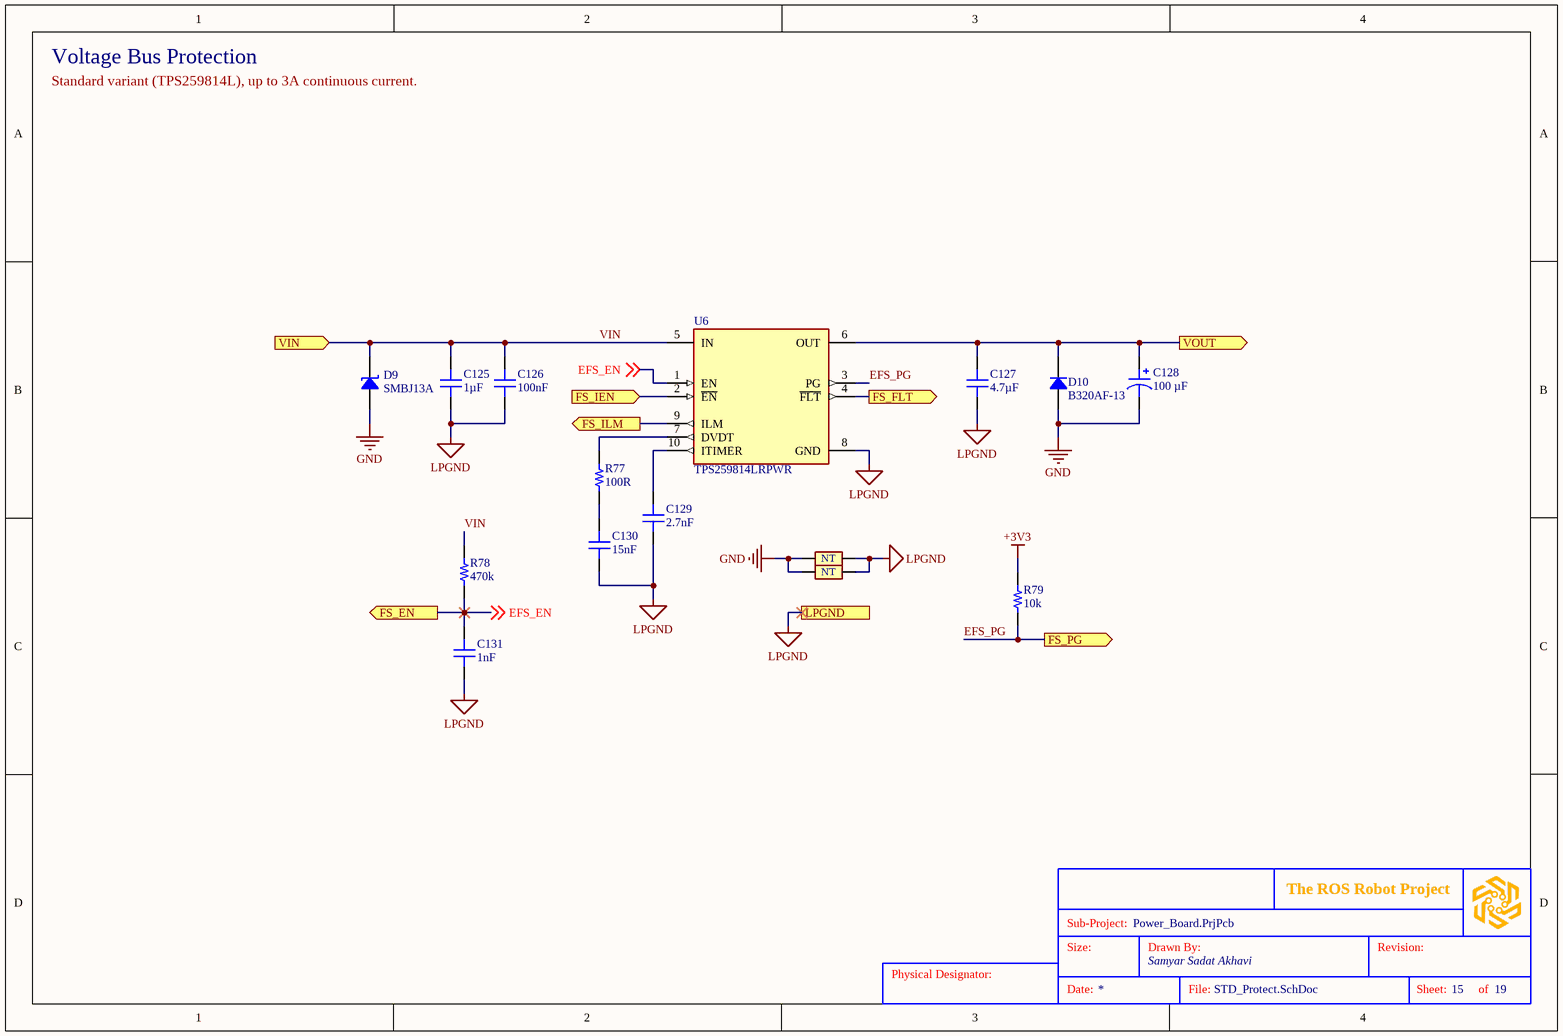
[diagram p4: STD_Protect.SchDoc]

### Parts
?  (no value)  (graphical)
C125  1µF  [CAP 0603_1608]
C126  100nF  [CAP 0603_1608]
C127  4.7µF  [CAP 1206_3216]
C128  100 µF  [CAP ALSMD 6.6MM H7.7MM]
C129  2.7nF  [CAP 0603_1608]
C130  15nF  [CAP 0603_1608]
C131  1nF  [CAP 0603_1608]
D9  SMBJ13A  [DO214AA SMB]
D10  B320AF-13  [DIODES INC SMAF]
GRAPH?  SGR-STDSDES  (value not drawn)  (graphical)
NT10  Net Tie  [Net_Tie_Via]  (value not drawn)  (net tie, no BOM)
NT11  Net Tie  [Net_Tie_Via]  (value not drawn)  (net tie, no BOM)
R77  100R  [RES 0603_1608]
R78  470k  [RES 0603_1608]
R79  10k  [RES 0603_1608]
U6  TPS259814LRPWR  [VQFN10_RPW_TEX]

### Ports
FS_EN (out, see Voltage_Regulators[2D]), FS_FLT (out, see Voltage_Regulators[3D]), FS_IEN (in, see Voltage_Regulators[2D]), FS_ILM (out, see Voltage_Regulators[2D]), FS_PG (out, see Voltage_Regulators[3D]), LPGND (see Voltage_Regulators[2D]), VIN (in, see Voltage_Regulators[2D]), VOUT (out, see Voltage_Regulators[3D])

### Nets
+3V3: R79.1
GND: C128.2 D9.1 D10.2 NT10.1 NT11.1
LPGND: C125.1 C126.1 C127.1 C129.1 C130.1 C131.1 NT10.2 NT11.2 U6.8(GND) ; port LPGND
EFS_EN: C131.2 R78.1 U6.1(EN) ; off-sheet EFS_EN, port FS_EN
EFS_PG: R79.2 U6.3(PG) ; port FS_PG
FS_FLT: U6.4(~{FLT}) ; port FS_FLT
FS_IEN: U6.2(~{EN}) ; port FS_IEN
FS_ILM: U6.9(ILM) ; port FS_ILM
VIN: C125.2 C126.2 D9.2 R78.2 U6.5(IN) ; port VIN
VOUT: C127.2 C128.1 D10.1 U6.6(OUT) ; port VOUT
NetC129_2: C129.2 U6.10(ITIMER)
NetC130_2: C130.2 R77.2
NetR77_1: R77.1 U6.7(DVDT)

### Channels
VOLT_REGS/PROT_3V3: designators end in _PROT_3V3; ports FS_EN=EN_PROT_3V3 FS_FLT=FS_GFLT FS_IEN=IEN_PROT_3V3 FS_ILM=ILM_PROT_3V3 FS_PG=3V3_VIO.FSPG LPGND=LPGND VIN=3V3RO VOUT=3V3PO
VOLT_REGS/PROT_12V: designators end in _PROT_12V; ports FS_EN=EN_PROT_12V FS_FLT=FS_GFLT FS_IEN=IEN_PROT_12V FS_ILM=ILM_PROT_12V FS_PG=12V_VIO.FSPG LPGND=LPGND VIN=12VRO VOUT=12VPO
VOLT_REGS/PROT_5V: designators end in _PROT_5V; ports FS_EN=EN_PROT_5V FS_FLT=FS_GFLT FS_IEN=IEN_PROT_5V FS_ILM=ILM_PROT_5V FS_PG=5V_VIO.FSPG LPGND=LPGND VIN=5VRO VOUT=5VPO

### Notes on the sheet
- Voltage Bus Protection
- Standard variant (TPS259814L), up to 3A continuous current.
- Sub-Project:
- Size:
- Drawn By:
- Revision:
- Date:
- File:
- Sheet:
- of
- (in symbol GEN-PCBVINT0S3) NT
- (in symbol SGR-STDSDES) Physical Designator:

### Library data of the parts
? = SGR-STDTBSA4: STANDARD SCHEMATICS TITLE BLOCK
C125 = GEN-CC1UT10V25KX7R603: as C27 on sheet Voltage_Reg_12V; Part Number: GEN-CC1UT10V25KX7R603; Value: 1µF
C126 = GEN-CC100NT10V50KX7R603: as C23 on sheet Voltage_Reg_12V; Part Number: GEN-CC100NT10V50KX7R603; Value: 100nF
C127 = GEN-CC4U7T10V25KX7R1206: as C39 on sheet Voltage_Reg_12V; Part Number: GEN-CC4U7T10V25KX7R1206; Value: 4.7µF
C128 = 865080445010: CAP ALUM 100UF 20% 25V SMD; manufacturer: Würth Elektronik; Impedance: 380 mOhms; Lifetime @ Temp.: 2000 Hrs @ 105°C; Polarization: Polar; Ripple Current @ High Frequency: 290 mA @ 100 kHz; Ripple Current @ Low Frequency: 188.5 mA @ 120 Hz; Surface Mount Land Size: 0.260" L x 0.260" W (6.60mm x 6.60mm); Part Number: 865080445010; Applications: General Purpose; Capacitance: 100 µF; componentlink1description: Datasheet; componentlink1url: https://katalog.we-online.de/pbs/datasheet/865080445010.pdf; componentlink2description: DigiKey Link; componentlink2url: https://www.digikey.com/en/products/detail/würth-elektronik/865080445010/5728033; Device Package: Radial, Can - SMD; Height - Seated (Max): 0.303" (7.70mm); lastupdated: 4/5/2026 8:54:41 PM; Lifecycle Status: Active; Minimum Order: 1; Mounting Type: Surface Mount; Operating Temperature: -55°C ~ 105°C; Package / Case: Radial, Can - SMD; packaging: TapeAndReel; partid: 8228; Part Status: Active; price: 0.16; series: WCAP-ASLI; Size / Dimension: 0.248" Dia (6.30mm); Supplier 1: DigiKey; Supplier Part Number 1: 732-8438-1-ND; Tolerance: ±20%; value: 100 µF; Voltage - Rated: 25 V
C129 = GEN-CC2N7T10V50KX7R603: as C22 on sheet Voltage_Reg_SBC; Part Number: GEN-CC2N7T10V50KX7R603; Value: 2.7nF
C130 = GEN-CC15NT5V16KX7R603: GENERIC 0603 MLC CAPACITOR; Tolerance: ±5%; Voltage: 16V; Dielectric: X7R; Part Number: GEN-CC15NT5V16KX7R603; Value: 15nF
C131 = GEN-CC1NT10V16KX7R603: GENERIC 0603 MLC CAPACITOR; Tolerance: ±10%; Voltage: 16V; Dielectric: X7R; Part Number: GEN-CC1NT10V16KX7R603; Value: 1nF
D9 = SMBJ13A: TVS DIODE 13VWM 21.5VC DO214AA; Manufacturer: Bourns Inc.; Current - Peak Pulse (10/1000µs): 28A; Power Line Protection: No; Power - Peak Pulse: 600W; Type: Zener; Unidirectional Channels: 1; Voltage - Breakdown (Min): 14.4V; Voltage - Clamping (Max) @ Ipp: 21.5V; Voltage - Reverse Standoff (Typ): 13V; Part Number: SMBJ13A; Applications: General Purpose; ComponentLink1Description: Datasheet; ComponentLink1URL: https://www.bourns.com/docs/Product-Datasheets/SMBJ.pdf; ComponentLink2Description: DigiKey Link; ComponentLink2URL: https://www.digikey.com/en/products/detail/bourns-inc/SMBJ13A/2254626; LastUpdated: 4/5/2026 8:33:25 PM; Lifecycle Status: Active; Minimum Order: 1; Mounting Type: Surface Mount; Operating Temperature: -55°C ~ 150°C (TJ); Package / Case: DO-214AA, SMB; Packaging: TapeAndReel; PartId: 10876; Part Status: Active; Price: 0.08; Series: SMBJ; Supplier 1: DigiKey; Supplier Part Number 1: SMBJ13ABCT-ND; Supplier Device Package: DO-214AA (SMB)
D10 = B320AF-13: DIODE SCHOTTKY 20V 3A SMAF; Manufacturer: Diodes Incorporated; Capacitance @ Vr, F: 140pF @ 4V, 1MHz; Current - Reverse Leakage @ Vr: 200 µA @ 20 V; Speed: Fast Recovery =< 500ns, > 200mA (Io); Voltage - Forward (Vf) (Max) @ If: 500 mV @ 3 A; Part Number: B320AF-13; ComponentLink1Description: Datasheet; ComponentLink1URL: https://www.diodes.com/assets/Datasheets/B320AF-B330AF.pdf; ComponentLink2Description: DigiKey Link; ComponentLink2URL: https://www.digikey.com/en/products/detail/diodes-incorporated/B320AF-13/7666773; Current - Average Rectified (Io): 3A; Diode Type: Schottky; LastUpdated: 4/5/2026 9:05:15 PM; Lifecycle Status: Active; Minimum Order: 1; Mounting Type: Surface Mount; Operating Temperature - Junction: -55°C ~ 150°C; Package / Case: DO-221AC, SMA Flat Leads; Packaging: TapeAndReel; PartId: 3424; Part Status: Active; Price: 0.05; Series: -; Supplier 1: DigiKey; Supplier Part Number 1: B320AF-13DICT-ND; Supplier Device Package: SMAF; Voltage - DC Reverse (Vr) (Max): 20 V
GRAPH? = SGR-STDSDES: STANDARD SHEET SYMBOL DESIGNATOR MARKING; Part Number: SGR-STDSDES
NT10 NT11 = GEN-PCBVINT0S3: VIA STYLE CIRCULAR NET TIE; Part Number: GEN-PCBVINT0S3; Size Variant: 0.3mm
R77 = GEN-CRR100T1P8603: GENERIC 0603 CHIP RESISTOR; Tolerance: ±1%; Power: 0.125W; Part Number: GEN-CRR100T1P8603; Value: 100R
R78 = GEN-CRR470KT1P8603: GENERIC 0603 CHIP RESISTOR; Tolerance: ±1%; Power: 0.125W; Part Number: GEN-CRR470KT1P8603; Value: 470k
R79 = GEN-CRR10KT1P8603: as R18 on sheet Voltage_Reg_12V; Part Number: GEN-CRR10KT1P8603; Value: 10k
U6 = TPS259814LRPWR: 2.7-V TO 16-V, 10-A, 6-M EFUSE W; Manufacturer: Texas Instruments; Copyright: Copyright (C) 2026 Ultra Librarian. All rights reserved.; Part Number: TPS259814LRPWR; Supplier 1: DigiKey; Supplier Part Number 1: 296-TPS259814LRPWRCT-ND

## Sheet HPW_Protect_SBC.SchDoc: =SheetTitle
size A4; SheetTitle: SBC Power Bus Protection; DrawnBy: Samyar Sadat Akhavi; DocumentNumber: 14; SheetNumber: 14; SheetTotal: 19
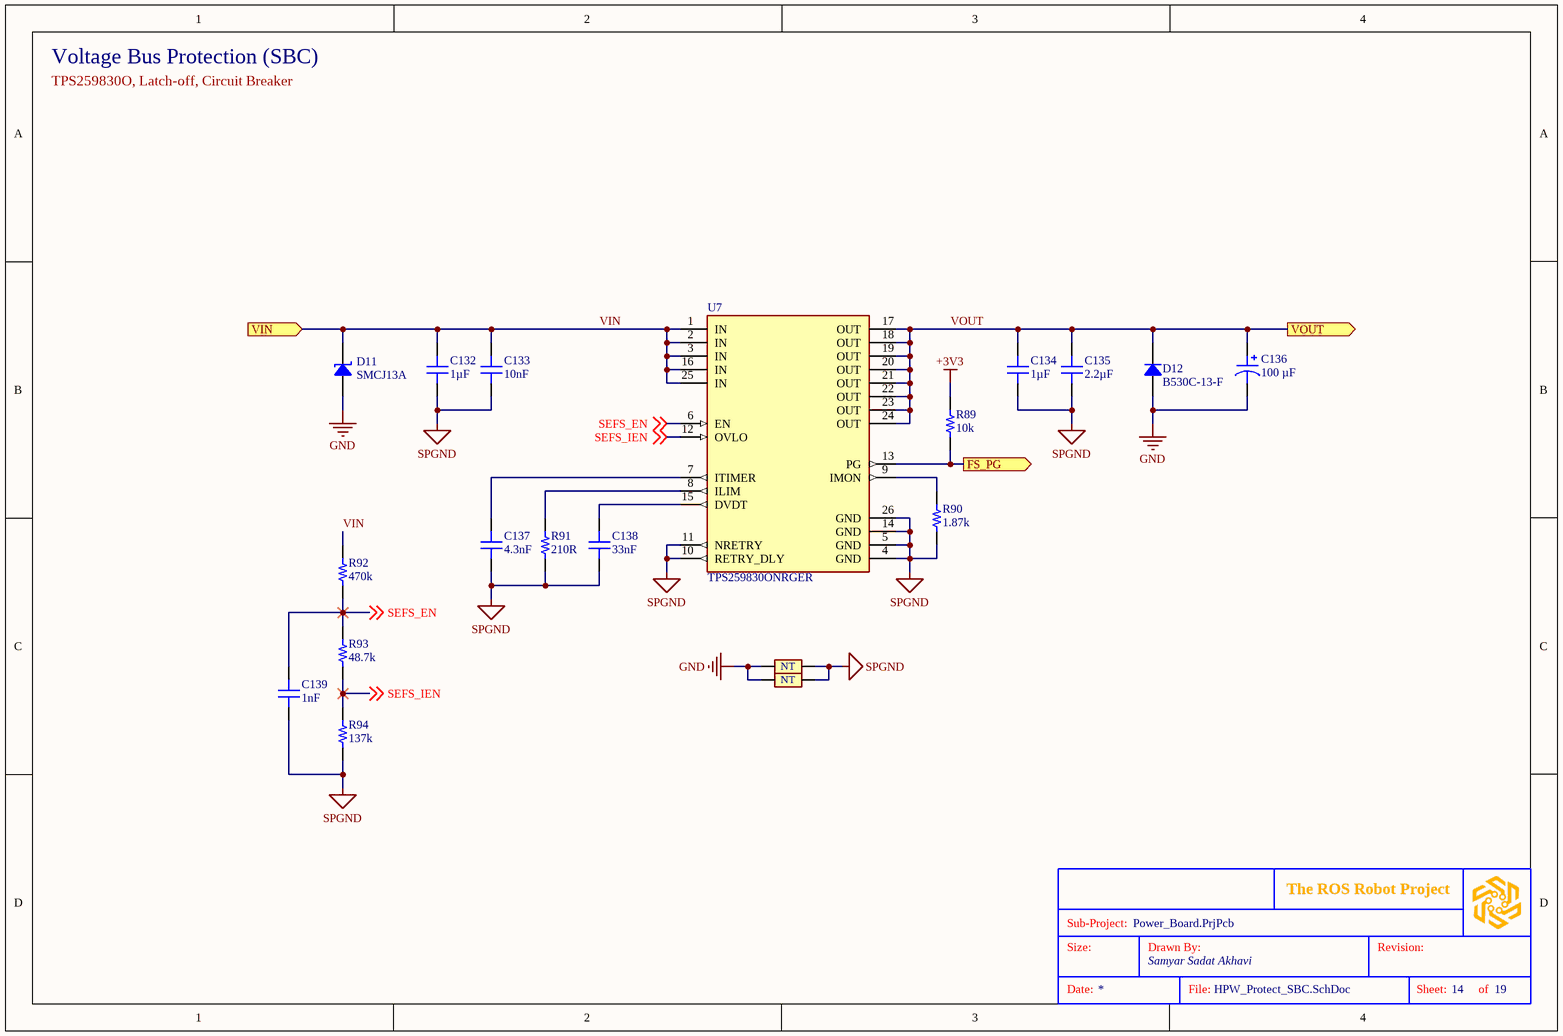
[diagram p5: HPW_Protect_SBC.SchDoc]

### Parts
(Parts that share a designator on the sheet are numbered #1, #2 ... from top to bottom, then left to right.)
?#5  (no value)  (graphical)
C132  1µF  [CAP 0603_1608]
C133  10nF  [CAP 0603_1608]
C134  1µF  [CAP 0603_1608]
C135  2.2µF  [CAP 0805_2012]
C136  100 µF  [CAP ALSMD 6.6MM H7.7MM]
C137  4.3nF  [CAP 0603_1608]
C138  33nF  [CAP 0603_1608]
C139  1nF  [CAP 0603_1608]
D11  SMCJ13A  [DO214AB SMC]
D12  B530C-13-F  [DO214AB SMC]
NT12  Net Tie  [Net_Tie_Via]  (value not drawn)  (net tie, no BOM)
NT13  Net Tie  [Net_Tie_Via]  (value not drawn)  (net tie, no BOM)
R89  10k  [RES 0603_1608]
R90  1.87k  [RES 0603_1608]
R91  210R  [RES 0603_1608]
R92  470k  [RES 0603_1608]
R93  48.7k  [RES 0603_1608]
R94  137k  [RES 0603_1608]
U7  TPS259830ONRGER  [VQFN24_RGE_TEX]

### Ports
FS_PG (out, see Voltage_Regulators[3A]), VIN (in, see Voltage_Regulators[2A]), VOUT (out, see Voltage_Regulators[3A])

### Nets
+3V3: R89.1
GND: C136.2 D11.1 D12.1 NT12.1 NT13.1
SPGND: C132.1 C133.2 C134.1 C135.1 C137.1 C138.1 C139.1 NT12.2 NT13.2 R90.1 R91.1 R94.1 U7.4(GND) U7.5(GND) U7.10(RETRY_DLY) U7.11(NRETRY) U7.14(GND) U7.26(GND)
VOUT: C134.2 C135.2 C136.1 D12.2 U7.17(OUT) U7.18(OUT) U7.19(OUT) U7.20(OUT) U7.21(OUT) U7.22(OUT) U7.23(OUT) U7.24(OUT) ; port VOUT  [project net VSBC]
SBC_VIO.FSPG: R89.2 U7.13(PG) ; port FS_PG
SEFS_EN: C139.2 R92.1 R93.2 U7.6(EN) ; off-sheet SEFS_EN
SEFS_IEN: R93.1 R94.2 U7.12(OVLO) ; off-sheet SEFS_IEN
VIN: C132.2 C133.1 D11.2 R92.2 U7.1(IN) U7.2(IN) U7.3(IN) U7.16(IN) U7.25(IN) ; port VIN  [project net VSBCRO]
NetC137_2: C137.2 U7.7(ITIMER)
NetC138_2: C138.2 U7.15(DVDT)
NetR90_2: R90.2 U7.9(IMON)
NetR91_2: R91.2 U7.8(ILIM)

### Notes on the sheet
- Voltage Bus Protection (SBC)
- TPS259830O, Latch-off, Circuit Breaker
- Sub-Project:
- Size:
- Drawn By:
- Revision:
- Date:
- File:
- Sheet:
- of
- (in symbol GEN-PCBVINT0S3) NT

### Library data of the parts
?#5 = SGR-STDTBSA4: STANDARD SCHEMATICS TITLE BLOCK
C132 C134 = GEN-CC1UT10V25KX7R603: as C27 on sheet Voltage_Reg_12V; Part Number: GEN-CC1UT10V25KX7R603; Value: 1µF
C133 = GEN-CC10NT10V50KX7R603: GENERIC 0603 MLC CAPACITOR; Tolerance: ±10%; Voltage: 50V; Dielectric: X7R; Part Number: GEN-CC10NT10V50KX7R603; Value: 10nF
C135 = GEN-CC2U2T10V25KX7R805: GENERIC 0805 MLC CAPACITOR; Tolerance: ±10%; Voltage: 25V; Dielectric: X7R; Part Number: GEN-CC2U2T10V25KX7R805; Value: 2.2µF
C136 = 865080445010: as C128 on sheet STD_Protect; Part Number: 865080445010; Applications: General Purpose; Capacitance: 100 µF; componentlink1description: Datasheet; componentlink1url: https://katalog.we-online.de/pbs/datasheet/865080445010.pdf; componentlink2description: DigiKey Link; componentlink2url: https://www.digikey.com/en/products/detail/würth-elektronik/865080445010/5728033; Device Package: Radial, Can - SMD; Height - Seated (Max): 0.303" (7.70mm); lastupdated: 4/5/2026 8:54:41 PM; Lifecycle Status: Active; Minimum Order: 1; Mounting Type: Surface Mount; Operating Temperature: -55°C ~ 105°C; Package / Case: Radial, Can - SMD; packaging: TapeAndReel; partid: 8228; Part Status: Active; price: 0.16; series: WCAP-ASLI; Size / Dimension: 0.248" Dia (6.30mm); Supplier 1: DigiKey; Supplier Part Number 1: 732-8438-1-ND; Tolerance: ±20%; value: 100 µF; Voltage - Rated: 25 V
C137 = GEN-CC4N3T5V50KC0G603: GENERIC 0603 MLC CAPACITOR; Tolerance: ±5%; Voltage: 50V; Dielectric: C0G; Part Number: GEN-CC4N3T5V50KC0G603; Value: 4.3nF
C138 = GEN-CC33NT5V25KX7R603: GENERIC 0603 MLC CAPACITOR; Tolerance: ±5%; Voltage: 25V; Dielectric: X7R; Part Number: GEN-CC33NT5V25KX7R603; Value: 33nF
C139 = GEN-CC1NT10V16KX7R603: as C131 on sheet STD_Protect; Part Number: GEN-CC1NT10V16KX7R603; Value: 1nF
D11 = SMCJ13A: TVS DIODE 13VWM 21.5VC DO214AB; Manufacturer: Littelfuse Inc.; Current - Peak Pulse (10/1000µs): 69.8A; Power Line Protection: No; Power - Peak Pulse: 1500W (1.5kW); Type: Zener; Unidirectional Channels: 1; Voltage - Breakdown (Min): 14.4V; Voltage - Clamping (Max) @ Ipp: 21.5V; Voltage - Reverse Standoff (Typ): 13V; Part Number: SMCJ13A; Applications: General Purpose; ComponentLink1Description: Datasheet; ComponentLink1URL: https://www.littelfuse.com/products/tvs-diodes/surface-mount/~/media/electronics/datasheets/tvs_diodes/littelfuse_tvs_diode_smcj_datasheet.pdf.pdf; ComponentLink2Description: DigiKey Link; ComponentLink2URL: https://www.digikey.com/en/products/detail/littelfuse-inc/SMCJ13A/762378; LastUpdated: 4/5/2026 8:33:56 PM; Lifecycle Status: Active; Minimum Order: 1; Mounting Type: Surface Mount; Operating Temperature: -55°C ~ 150°C (TJ); Package / Case: DO-214AB, SMC; Packaging: TapeAndReel; PartId: 6718; Part Status: Active; Price: 0.16; Series: SMCJ; Supplier 1: DigiKey; Supplier Part Number 1: SMCJ13ALFCT-ND; Supplier Device Package: DO-214AB (SMCJ)
D12 = B530C-13-F: DIODE SCHOTTKY 30V 5A SMC; Manufacturer: Diodes Incorporated; Capacitance @ Vr, F: 300pF @ 4V, 1MHz; Current - Reverse Leakage @ Vr: 500 µA @ 30 V; Speed: Fast Recovery =< 500ns, > 200mA (Io); Voltage - Forward (Vf) (Max) @ If: 550 mV @ 5 A; Part Number: B530C-13-F; ComponentLink1Description: Datasheet; ComponentLink1URL: https://www.diodes.com/assets/Datasheets/ds13012.pdf; ComponentLink2Description: DigiKey Link; ComponentLink2URL: https://www.digikey.com/en/products/detail/diodes-incorporated/B530C-13-F/768770; Current - Average Rectified (Io): 5A; Diode Type: Schottky; LastUpdated: 4/5/2026 8:31:14 PM; Lifecycle Status: Active; Minimum Order: 1; Mounting Type: Surface Mount; Operating Temperature - Junction: -55°C ~ 150°C; Package / Case: DO-214AB, SMC; Packaging: CutTape; PartId: 1719; Part Status: Active; Price: 0.30; Series: -; Supplier 1: DigiKey; Supplier Part Number 1: B530C-FDICT-ND; Supplier Device Package: SMC; Voltage - DC Reverse (Vr) (Max): 30 V
NT12 NT13 = GEN-PCBVINT0S3: VIA STYLE CIRCULAR NET TIE; Part Number: GEN-PCBVINT0S3; Size Variant: 0.3mm
R89 = GEN-CRR10KT1P8603: as R18 on sheet Voltage_Reg_12V; Part Number: GEN-CRR10KT1P8603; Value: 10k
R90 = GEN-CRR1K87T1P8603: GENERIC 0603 CHIP RESISTOR; Tolerance: ±1%; Power: 0.125W; Part Number: GEN-CRR1K87T1P8603; Value: 1.87k
R91 = GEN-CRR210T1P8603: GENERIC 0603 CHIP RESISTOR; Tolerance: ±1%; Power: 0.125W; Part Number: GEN-CRR210T1P8603; Value: 210R
R92 = GEN-CRR470KT1P8603: as R78 on sheet STD_Protect; Part Number: GEN-CRR470KT1P8603; Value: 470k
R93 = GEN-CRR48K7T1P8603: as R64 on sheet Voltage_Regulators; Part Number: GEN-CRR48K7T1P8603; Value: 48.7k
R94 = GEN-CRR137KT1P8603: as R69 on sheet Voltage_Regulators; Part Number: GEN-CRR137KT1P8603; Value: 137k
U7 = TPS259830ONRGER: 2.7-V TO 26-V, 2.7-M 18-A INTEGR; Manufacturer: Texas Instruments; Copyright: Copyright (C) 2025 Ultra Librarian. All rights reserved.; Part Number: TPS259830ONRGER; Supplier 1: DigiKey; Supplier Part Number 1: 296-TPS259830ONRGERCT-ND

## Sheet Voltage_Buck_3A.SchDoc: =SheetTitle
size A4; SheetTitle: TPS51386 Buck Regulator; DrawnBy: Samyar Sadat Akhavi; DocumentNumber: 13; SheetNumber: 13; SheetTotal: 19
Used 2 times, as channels VOLT_REGS/VREG_3V3, VOLT_REGS/VREG_5V. Parts and nets are listed once, with the designators drawn on the sheet.
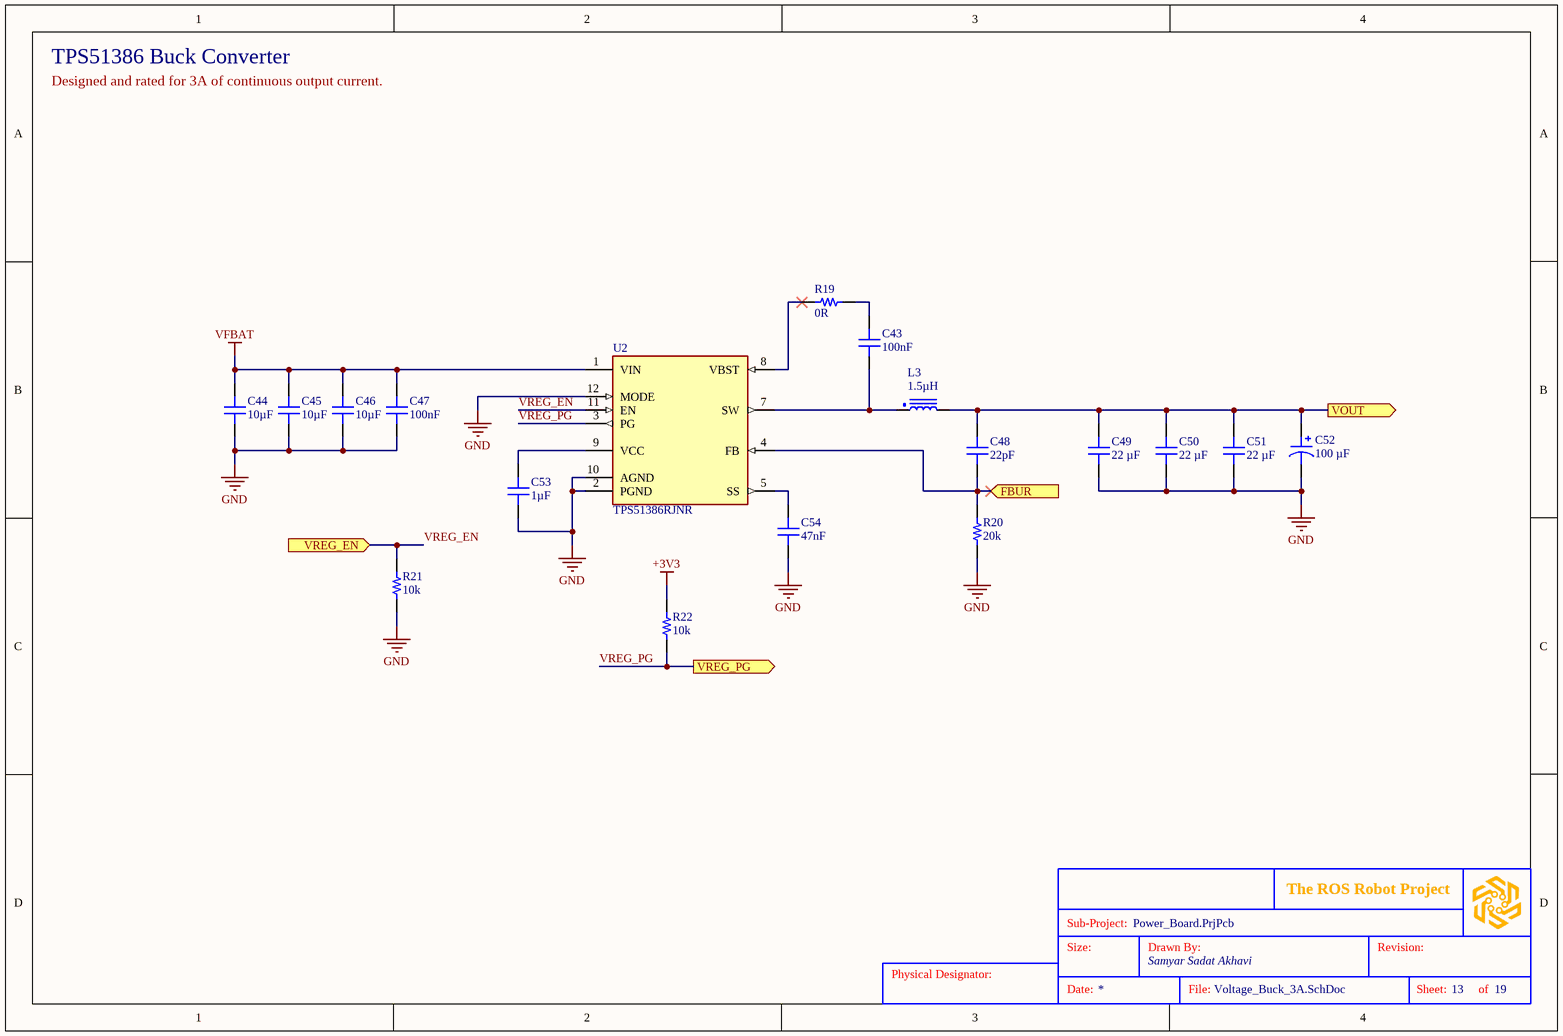
[diagram p6: Voltage_Buck_3A.SchDoc]

### Parts
?  (no value)  (graphical)
C43  100nF  [CAP 0603_1608]
C44  10µF  [CAP 1206_3216]
C45  10µF  [CAP 1206_3216]
C46  10µF  [CAP 1206_3216]
C47  100nF  [CAP 0603_1608]
C48  22pF  [CAP 0603_1608]
C49  22 µF  [CAP 1206_3216 - 0.8MM]
C50  22 µF  [CAP 1206_3216 - 0.8MM]
C51  22 µF  [CAP 1206_3216 - 0.8MM]
C52  100 µF  [CAP ALSMD 6.6MM H7.7MM]
C53  1µF  [CAP 0603_1608]
C54  47nF  [CAP 0603_1608]
GRAPH?  SGR-STDSDES  (value not drawn)  (graphical)
L3  1.5µH  [WE-HCC_807021]
R19  0R  [RES 0603_1608]
R20  20k  [RES 0603_1608]
R21  10k  [RES 0603_1608]
R22  10k  [RES 0603_1608]
U2  TPS51386RJNR  [VQFN-HR12_RJN_TEX]

### Ports
FBUR (in, see Voltage_Regulators[2D]), VOUT (out, see Voltage_Regulators[2D]), VREG_EN (in, see Voltage_Regulators[1D]), VREG_PG (out, see Voltage_Regulators[1D])

### Nets
+3V3: R22.1
GND: C44.1 C45.1 C46.1 C47.1 C49.1 C50.1 C51.1 C52.2 C53.1 C54.1 R20.1 R21.2 U2.2(PGND) U2.10(AGND) U2.12(MODE)
VFBAT: C44.2 C45.2 C46.2 C47.2 U2.1(VIN)
FBUR: C48.1 R20.2 U2.4(FB) ; port FBUR
VOUT: C48.2 C49.2 C50.2 C51.2 C52.1 L3.2 ; port VOUT
VREG_EN: R21.1 U2.11(EN) ; port VREG_EN
VREG_PG: R22.2 U2.3(PG) ; port VREG_PG
NetC43_1: C43.1 L3.1 U2.7(SW)
NetC43_2: C43.2 R19.2
NetC53_2: C53.2 U2.9(VCC)
NetC54_2: C54.2 U2.5(SS)
NetR19_1: R19.1 U2.8(VBST)

### Channels
VOLT_REGS/VREG_3V3: designators end in _VREG_3V3; ports FBUR=FBUR VOUT=3V3RO VREG_EN=3V3_VIO.VEN VREG_PG=3V3_VIO.VPG
VOLT_REGS/VREG_5V: designators end in _VREG_5V; ports FBUR=FBUR VOUT=5VRO VREG_EN=5V_VIO.VEN VREG_PG=5V_VIO.VPG

### Notes on the sheet
- TPS51386 Buck Converter
- Designed and rated for 3A of continuous output current.
- Sub-Project:
- Size:
- Drawn By:
- Revision:
- Date:
- File:
- Sheet:
- of
- (in symbol SGR-STDSDES) Physical Designator:

### Library data of the parts
? = SGR-STDTBSA4: STANDARD SCHEMATICS TITLE BLOCK
C43 C47 = GEN-CC100NT10V50KX7R603: as C23 on sheet Voltage_Reg_12V; Part Number: GEN-CC100NT10V50KX7R603; Value: 100nF
C44-C46 = GEN-CC10UT10V25KX7R1206: as C25 on sheet Voltage_Reg_12V; Part Number: GEN-CC10UT10V25KX7R1206; Value: 10µF
C48 = GEN-CC22PT10V16KX7R603: as C38 on sheet Voltage_Reg_12V; Part Number: GEN-CC22PT10V16KX7R603; Value: 22pF
C49-C51 = CL31A226KAHNNNE: as C15 on sheet Voltage_Reg_SBC; Part Number: CL31A226KAHNNNE; Capacitance: 22 µF; Applications: General Purpose; componentlink1description: Datasheet; componentlink1url: http://www.samsungsem.com/kr/support/product-search/mlcc/CL31A226KAHNNNE.jsp; componentlink2description: DigiKey Link; componentlink2url: https://www.digikey.com/en/products/detail/samsung-electro-mechanics/CL31A226KAHNNNE/3888705; Device Package: 1206 (3216 Metric); lastupdated: 4/6/2026 7:37:25 PM; Lifecycle Status: Active; Minimum Order: 1; Mounting Type: Surface Mount, MLCC; Operating Temperature: -55°C ~ 85°C; Package / Case: 1206 (3216 Metric); packaging: TapeAndReel; partid: 22185; Part Status: Active; price: 0.06; series: CL; Size / Dimension: 0.126" L x 0.063" W (3.20mm x 1.60mm); Supplier 1: DigiKey; Supplier Part Number 1: 1276-3047-1-ND; Temperature Coefficient: X5R; Thickness (Max): 0.071" (1.80mm); value: 22 µF; Voltage - Rated: 25V
C52 = 865080445010: as C128 on sheet STD_Protect; Part Number: 865080445010; Applications: General Purpose; Capacitance: 100 µF; componentlink1description: Datasheet; componentlink1url: https://katalog.we-online.de/pbs/datasheet/865080445010.pdf; componentlink2description: DigiKey Link; componentlink2url: https://www.digikey.com/en/products/detail/würth-elektronik/865080445010/5728033; Device Package: Radial, Can - SMD; Height - Seated (Max): 0.303" (7.70mm); lastupdated: 4/5/2026 8:54:41 PM; Lifecycle Status: Active; Minimum Order: 1; Mounting Type: Surface Mount; Operating Temperature: -55°C ~ 105°C; Package / Case: Radial, Can - SMD; packaging: TapeAndReel; partid: 8228; Part Status: Active; price: 0.16; series: WCAP-ASLI; Size / Dimension: 0.248" Dia (6.30mm); Supplier 1: DigiKey; Supplier Part Number 1: 732-8438-1-ND; Tolerance: ±20%; value: 100 µF; Voltage - Rated: 25 V
C53 = GEN-CC1UT10V25KX7R603: as C27 on sheet Voltage_Reg_12V; Part Number: GEN-CC1UT10V25KX7R603; Value: 1µF
C54 = GEN-CC47NT5V25KX7R603: GENERIC 0603 MLC CAPACITOR; Tolerance: ±5%; Voltage: 25V; Dielectric: X7R; Part Number: GEN-CC47NT5V25KX7R603; Value: 47nF
GRAPH? = SGR-STDSDES: STANDARD SHEET SYMBOL DESIGNATOR MARKING; Part Number: SGR-STDSDES
L3 = 7443340150: FIXED IND 1.5UH 16.5A 5.6 MOHM; Manufacturer: Würth Elektronik; Tolerance: ±20%; Saturation Current: 18.5A; Part Number: 7443340150; Value: 1.5µH; Current Rating: 16.5A; DC Resistance: 5.6mOhm; Supplier 1: DigiKey; Supplier Part Number 1: 732-2163-1-ND
R19 = GEN-CRR0603: GENERIC 0603 CHIP RESISTOR (JUMPER); Part Number: GEN-CRR0603; Value: 0R
R20 = GEN-CRR20KT1P8603: GENERIC 0603 CHIP RESISTOR; Tolerance: ±1%; Power: 0.125W; Part Number: GEN-CRR20KT1P8603; Value: 20k
R21 R22 = GEN-CRR10KT1P8603: as R18 on sheet Voltage_Reg_12V; Part Number: GEN-CRR10KT1P8603; Value: 10k
U2 = TPS51386RJNR: IC REG BUCK ADJ 8A 12VQFN; Manufacturer: Texas Instruments; Copyright: Copyright (C) 2026 Ultra Librarian. All rights reserved.; Part Number: TPS51386RJNR; Supplier 1: DigiKey; Supplier Part Number 1: 296-TPS51386RJNRCT-ND